# Altium project OK10xx_S V1.1.PrjPCB
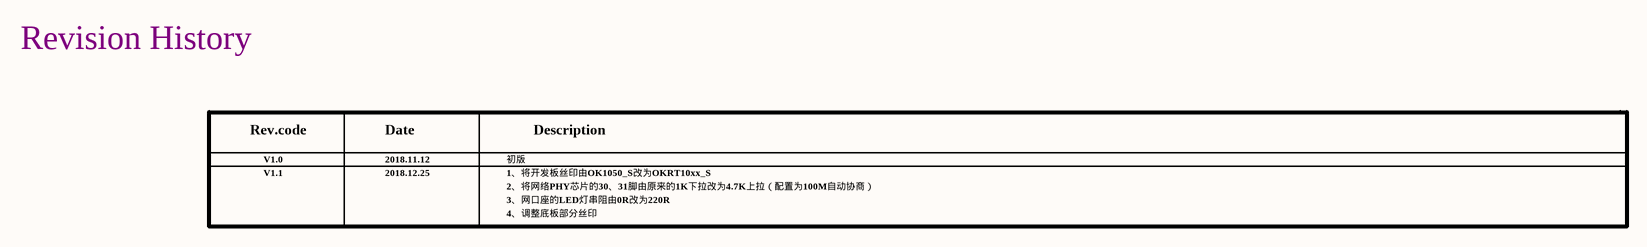
[diagram p0: RELEASE.SchDoc]
7 sheets, 234 parts. Net scope: global (net labels, ports and power ports of the same name join across sheets).
Board file: OK10xx_S V1.1.PcbDoc
Sheets:
  RELEASE.SchDoc
  POWER&RTC.SchDoc
  NET.SchDoc
  AUDIO.SchDoc
  OK10xx_S V1.1.SchDoc
  TF_CARD&USB.SchDoc
  Camera.SchDoc

## Sheet RELEASE.SchDoc
size A3; Revision: 1.0; SheetNumber: 1; SheetTotal: 7

### Notes on the sheet
- Revision History
- Rev.code
- Date
- Description
- V1.0
- V1.1
- 2018.11.12
- 2018.12.25
- 初版
- 1、将开发板丝印由OK1050_S改为OKRT10xx_S
- 2、将网络PHY芯片的30、31脚由原来的1K下拉改为4.7K上拉（配置为100M自动协商）
- 3、网口座的LED灯串阻由0R改为220R
- 4、调整底板部分丝印
- 设计
- 审核
- 工艺
- 图纸名称
- 郝成东
- 批准
- 标准化
- 日期
- 版本
- 页码
- 第
- 页
- 共

## Sheet POWER&RTC.SchDoc
size A3; Revision: 1.0; SheetNumber: 3; SheetTotal: 7
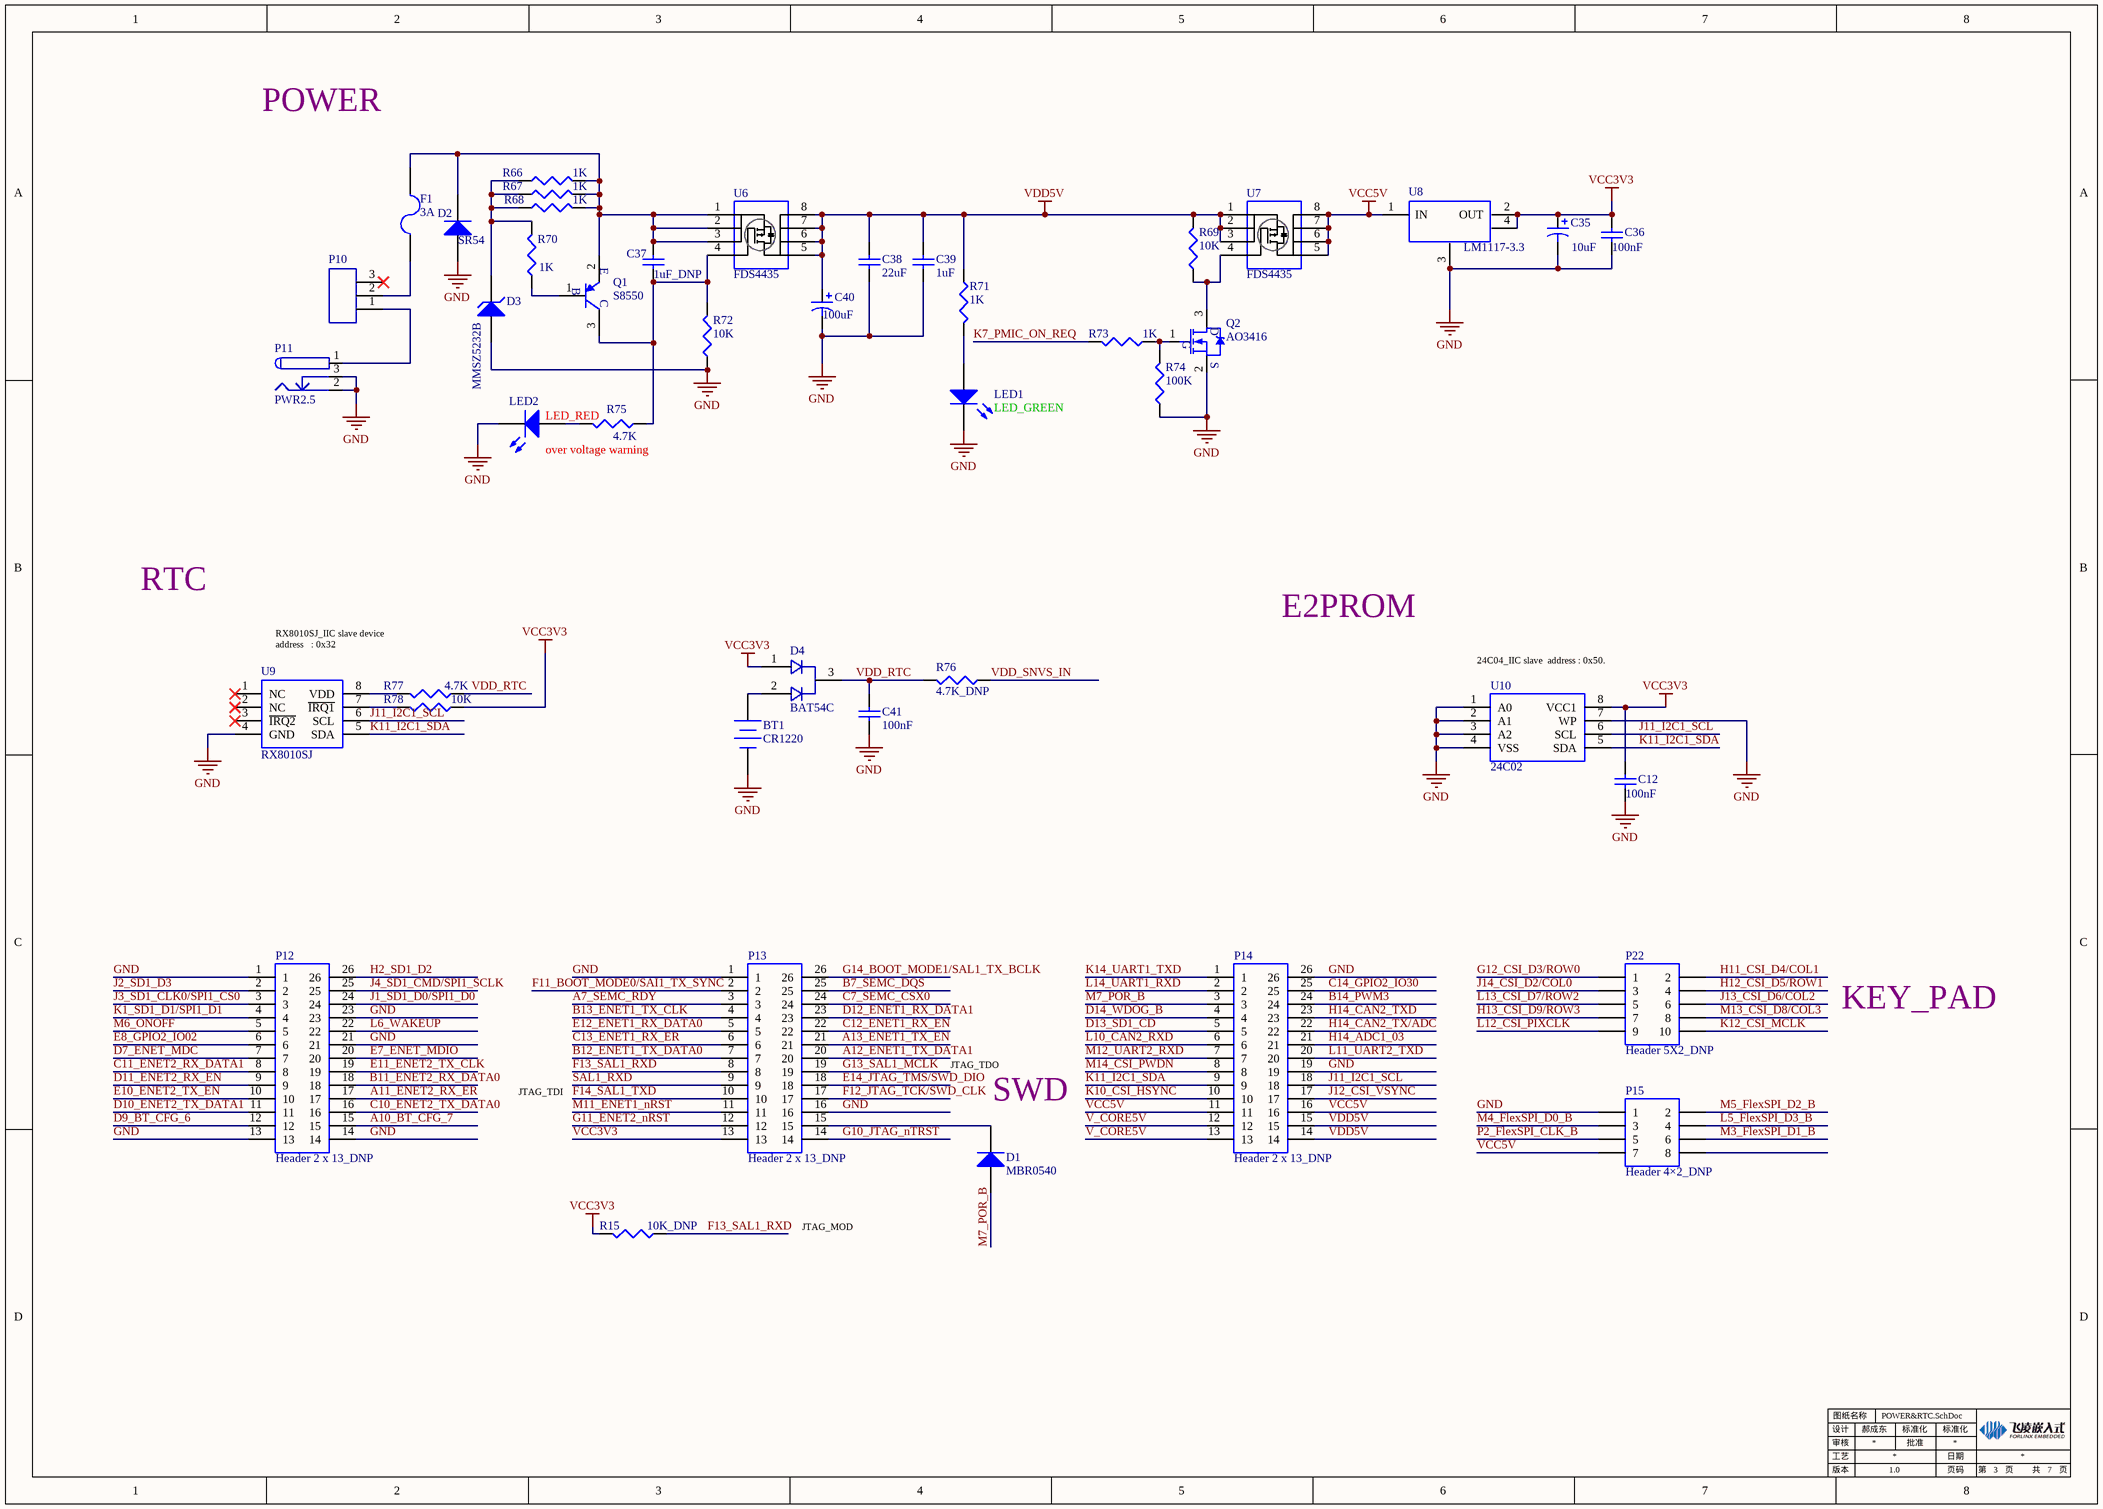
[diagram p1: POWER&RTC.SchDoc]

### Parts
BT1  CR1220  [BH-1220 BATTERY]
C12  100nF  [0603C+]
C35  10uF  [TC3216A]
C36  100nF  [0603C+]
C37  1uF_DNP  [0603C+]
C38  22uF  [0603C+]
C39  1uF  [0603C+]
C40  100uF  [TC3528B]
C41  100nF  [0603C+]
D1  MBR0540  [Diode1.6*2.6]
D2  SR54  [SMB/DO-214AA]
D3  MMSZ5232B  [Diode1.6*2.6]
D4  BAT54C  [SOT23]
F1  3A  [R_1210]
LED1  LED_GREEN  [LED0603_M1608]
LED2  LED_RED  [LED0603_M1608]
P10  P18  [SW01]  (value not drawn)
P11  PWR2.5  [JACK-2.5MM_B]
P12  Header 2 x 13_DNP  [HDR2X13]
P13  Header 2 x 13_DNP  [HDR2X13]
P14  Header 2 x 13_DNP  [HDR2X13]
P15  Header 4×2_DNP  [HDR2X4]
P22  Header 5X2_DNP  [HDR2X5]
Q1  S8550  [SOT95P245X110-3N]
Q2  AO3416  [SOT95P245X110-3N]
R15  10K_DNP  [0603R+]
R66  1K  [0603R+]
R67  1K  [0603R+]
R68  1K  [0603R+]
R69  10K  [0603R+]
R70  1K  [0603R+]
R71  1K  [0603R+]
R72  10K  [0603R+]
R73  1K  [0603R+]
R74  100K  [0603R+]
R75  4.7K  [0603R+]
R76  4.7K_DNP  [0603R+]
R77  4.7K  [0603R+]
R78  10K  [0603R+]
U6  FDS4435  [FDS4435]
U7  FDS4435  [FDS4435]
U8  LM1117-3.3  [LM1117]
U9  RX8010SJ  [RX8010SJ]
U10  24C02  [24C04_SO8]

### Nets
GND: BT1.2(-) C12.1 C35.2 C36.1 C38.2 C39.2 C40.2 C41.1 D2.1(A) D3.1(A) LED1.2(K) LED2.2(K) P11.2(ADJ) P11.3(ADJ) P12.1 P12.13 P12.14 P12.21 P12.23 P13.1 P13.16 P14.19 P14.26 P15.1 Q2.2(S) R72.1 R74.1 U8.3(GND) U9.4(GND) U10.1(A0) U10.2(A1) U10.3(A2) U10.4(VSS) U10.7(WP)
VCC3V3: C12.2 C35.1 C36.2 D4.1 P13.13 R15.2 R78.1 U8.2(OUT) U8.4 U10.8(VCC1)
VCC5V: P14.11 P14.16 P15.7 U7.5(D) U7.6(D) U7.7(D) U7.8(D) U8.1(IN)
VDD5V: C38.1 C39.1 C40.1 P14.14 P14.15 R69.2 R71.1 U6.5(D) U6.6(D) U6.7(D) U6.8(D) U7.1(S) U7.2(S) U7.3(S)
A7_SEMC_RDY: P13.3
A10_BT_CFG_7: P12.15
A11_ENET2_RX_ER: P12.17
A12_ENET1_TX_DATA1: P13.20
A13_ENET1_TX_EN: P13.21
B7_SEMC_DQS: P13.25
B11_ENET2_RX_DATA0: P12.18
B12_ENET1_TX_DATA0: P13.7
B13_ENET1_TX_CLK: P13.4
B14_PWM3: P14.24
C7_SEMC_CSX0: P13.24
C10_ENET2_TX_DATA0: P12.16
C11_ENET2_RX_DATA1: P12.8
C12_ENET1_RX_EN: P13.22
C13_ENET1_RX_ER: P13.6
C14_GPIO2_IO30: P14.25
D7_ENET_MDC: P12.7
D9_BT_CFG_6: P12.12
D10_ENET2_TX_DATA1: P12.11
D11_ENET2_RX_EN: P12.9
D12_ENET1_RX_DATA1: P13.23
D13_SD1_CD: P14.5
D14_WDOG_B: P14.4
E7_ENET_MDIO: P12.20
E8_GPIO2_IO02: P12.6
E10_ENET2_TX_EN: P12.10
E11_ENET2_TX_CLK: P12.19
E12_ENET1_RX_DATA0: P13.5
E14_JTAG_TMS/SWD_DIO: P13.18
F11_BOOT_MODE0/SAI1_TX_SYNC: P13.2
F12_JTAG_TCK/SWD_CLK: P13.17
F13_SAL1_RXD: P13.8 R15.1
F14_SAL1_TXD: P13.10
G10_JTAG_nTRST: P13.14
G11_ENET2_nRST: P13.12
G12_CSI_D3/ROW0: P22.1
G13_SAL1_MCLK: P13.19
G14_BOOT_MODE1/SAL1_TX_BCLK: P13.26
H2_SD1_D2: P12.26
H11_CSI_D4/COL1: P22.2
H12_CSI_D5/ROW1: P22.4
H13_CSI_D9/ROW3: P22.7
H14_ADC1_03: P14.21
H14_CAN2_TX/ADC: P14.22
H14_CAN2_TXD: P14.23
J1_SD1_D0/SPI1_D0: P12.24
J2_SD1_D3: P12.2
J3_SD1_CLK0/SPI1_CS0: P12.3
J4_SD1_CMD/SPI1_SCLK: P12.25
J11_I2C1_SCL: P14.18 U9.6(SCL) U10.6(SCL)
J12_CSI_VSYNC: P14.17
J13_CSI_D6/COL2: P22.6
J14_CSI_D2/COL0: P22.3
K1_SD1_D1/SPI1_D1: P12.4
K7_PMIC_ON_REQ: R73.2
K10_CSI_HSYNC: P14.10
K11_I2C1_SDA: P14.9 U9.5(SDA) U10.5(SDA)
K12_CSI_MCLK: P22.10
K14_UART1_TXD: P14.1
L5_FlexSPI_D3_B: P15.4
L6_WAKEUP: P12.22
L10_CAN2_RXD: P14.6
L11_UART2_TXD: P14.20
L12_CSI_PIXCLK: P22.9
L13_CSI_D7/ROW2: P22.5
L14_UART1_RXD: P14.2
M3_FlexSPI_D1_B: P15.6
M4_FlexSPI_D0_B: P15.3
M5_FlexSPI_D2_B: P15.2
M6_ONOFF: P12.5
M7_POR_B: D1.1(A) P14.3
M11_ENET1_nRST: P13.11
M12_UART2_RXD: P14.7
M13_CSI_D8/COL3: P22.8
M14_CSI_PWDN: P14.8
P2_FlexSPI_CLK_B: P15.5
SAL1_RXD: P13.9
V_CORE5V: P14.12 P14.13
VDD_RTC: C41.2 D4.3 R76.2 R77.1
VDD_SNVS_IN: R76.1
NetBT1_1: BT1.1(+) D4.2
NetC37_1: C37.1 D2.2(K) F1.2 Q1.2(E) R66.2 R67.2 R68.2 U6.1(S) U6.2(S) U6.3(S)
NetC37_2: C37.2 Q1.3(C) R72.2 R75.1 U6.4(G)
NetD1_2: D1.2(K) P13.15
NetD3_2: D3.2(K) R66.1 R67.1 R68.1 R70.2
NetF1_1: F1.1 P10.2(DQ17)
NetLED1_1: LED1.1(A) R71.2
NetLED2_1: LED2.1(A) R75.2
NetP10_1: P10.1(DQ16) P11.1(ADJ)
NetQ1_1: Q1.1(B) R70.1
NetQ2_1: Q2.1(G) R73.1 R74.2
NetQ2_3: Q2.3(D) R69.1 U7.4(G)
NetR77_2: R77.2 U9.8(VDD)
NetR78_2: R78.2 U9.7(~{IRQ1})

Not connected (* = marked no-connect by the designer): P10 3(DQ18)*; P15 8; U9 1(NC)* 2(NC)* 3(~{IRQ2})*

### Notes on the sheet
- POWER
- over voltage warning
- RTC
- RX8010SJ_IIC slave device address   : 0x32
- E2PROM
- (near U10) 24C04_IIC slave  address : 0x50.
- KEY_PAD
- JTAG_TDI
- JTAG_TDO
- (near D1) SWD
- JTAG_MOD
- 设计
- 审核
- 工艺
- 图纸名称
- 郝成东
- 批准
- 标准化
- 日期
- 版本
- 页码
- 第
- 页
- 共

### Library data of the parts
BT1 = Battery: Multicell Battery; Published: 24-Mar-1999; LatestRevisionDate: 17-Jul-2002; LatestRevisionNote: Re-released for DXP Platform.; PackageReference: BAT-2; Publisher: Altium Limited; PackageDescription: Battery; 2 Leads
C12 C36 = CAP: Capacitor; Value: 100nF; Published: 8-Jun-2000; LatestRevisionDate: 17-Jul-2002; LatestRevisionNote: Re-released for DXP Platform.; PackageReference: RAD-0.3; Publisher: Altium Limited; PackageDescription: Radial Cap, Thru-Hole; 2 Leads; 0.3 in Pin Spacing
C35 C40 = Cap Pol1: Polarized Capacitor (Radial); Published: 8-Jun-2000; LatestRevisionDate: 17-Jul-2002; LatestRevisionNote: Re-released for DXP Platform.; PackageReference: RB7.6-15; Publisher: Altium Limited; PackageDescription: Polarized Capacitor (Radial); 2 Leads
  C35: Value: 10uF
  C40: Value: 100uF
C37-C39 C41 = Cap: Capacitor; Published: 8-Jun-2000; LatestRevisionDate: 17-Jul-2002; LatestRevisionNote: Re-released for DXP Platform.; PackageReference: RAD-0.3; Publisher: Altium Limited; PackageDescription: Radial Cap, Thru-Hole; 2 Leads; 0.3 in Pin Spacing
  C37: Value: 1uF_DNP
  C38: Value: 22uF
  C39: Value: 1uF
  C41: Value: 100nF
D1 D2 = Diode: Default Diode; Published: 8-Jun-2000; LatestRevisionDate: 17-Jul-2002; LatestRevisionNote: Re-released for DXP Platform.; PackageVersion: Sep-1996; PackageReference: SMC; Publisher: Altium Limited; PackageDescription: DO-214-AB/SMC; 2 C-Bend Leads; Body 7.9 x 5.9 mm, inc. leads (LxW); Code_JEDEC: DO-214-AB
D3 = D Zener: Zener Diode; Published: 8-Jun-2000; LatestRevisionDate: 17-Jul-2002; LatestRevisionNote: Re-released for DXP Platform.; PackageReference: DIODE-0.7; Publisher: Altium Limited; PackageDescription: Diode, Thru-Hole; 2 Leads; 0.7 in Pin Spacing
F1 = Fuse 2: Fuse; Published: 8-Jun-2000; LatestRevisionDate: 17-Jul-2002; LatestRevisionNote: Re-released for DXP Platform.; PackageReference: PIN-W2/E2.8; Publisher: Altium Limited; PackageDescription: Thru-Hole; 2 Leads; Value: 3A
LED1 LED2 = LED2: Typical RED, GREEN, YELLOW, AMBER GaAs LED; Published: 8-Jun-2000; LatestRevisionDate: 17-Jul-2002; LatestRevisionNote: Re-released for DXP Platform.; PackageVersion: Feb-2002; PackageReference: 3.2X1.6X1.1; Publisher: Altium Limited; PackageDescription: SM LED; 2 Flat Leads; Value: RED
P10 = CON3
P12-P14 = Header 2 x 13
P15 = Header 4×2
P22 = Header 5X2: Header, 5-Pin, Dual row; LatestRevisionDate: 17-Jul-2002; LatestRevisionNote: Re-released for DXP Platform.; Publisher: Altium Limited
Q1 = PNP: NPN Bipolar Transistor; Published: 8-Jun-2000; LatestRevisionDate: 17-Jul-2002; LatestRevisionNote: Re-released for DXP Platform.; PackageReference: TO-226-AA; Publisher: Altium Limited; PackageDescription: TO, Flat Index; 3 In-Line, Axial Leads; Body Dia. 4.8mm; Leads 0.55 x 0.51 mm (max); Code_JEDEC: TO-226-AA; VALUE: S8550
Q2 = NMOS: N-Channel Power MOSFET; Note: Pin 2 is electrically connected to pin 4.; Published: 8-Jun-2000; LatestRevisionDate: 17-Jul-2002; LatestRevisionNote: Re-released for DXP Platform.; DatasheetVersion: PD-9.814; PackageVersion: Feb-1997; PackageReference: TO-220AB; Publisher: Altium Limited; PackageDescription: TO, Thru-Hole, Vertical, Heatsink Mounted; 3 In-Line Leads; Pitch 2.54 mm; ComponentLink1Description: Manufacturer Link; ComponentLink1URL: http://www.irf.com/; VALUE: AO3416
R15 R66-R78 = Res3: Resistor; Published: 8-Jun-2000; LatestRevisionDate: 29-May-2009; LatestRevisionNote: IPC-7351 Footprint Added.; PackageReference: J1-0603; Publisher: Altium Limited; PackageDescription: Chip Resistor
  R15: Value: 10K_DNP
  R66-R68 R70 R71 R73: Value: 1K
  R69 R72 R78: Value: 10K
  R74: Value: 100K
  R75 R77: Value: 4.7K
  R76: Value: 4.7K_DNP
U8 = LM1117: Value: LM1117-3.3
U10 = 24C04_SO8
D4 = BAT54C: Value: BAT54C
U9 = RX8010SJ: Value: RX8010SJ

## Sheet NET.SchDoc
size A3; Revision: 1.0; SheetNumber: 4; SheetTotal: 7
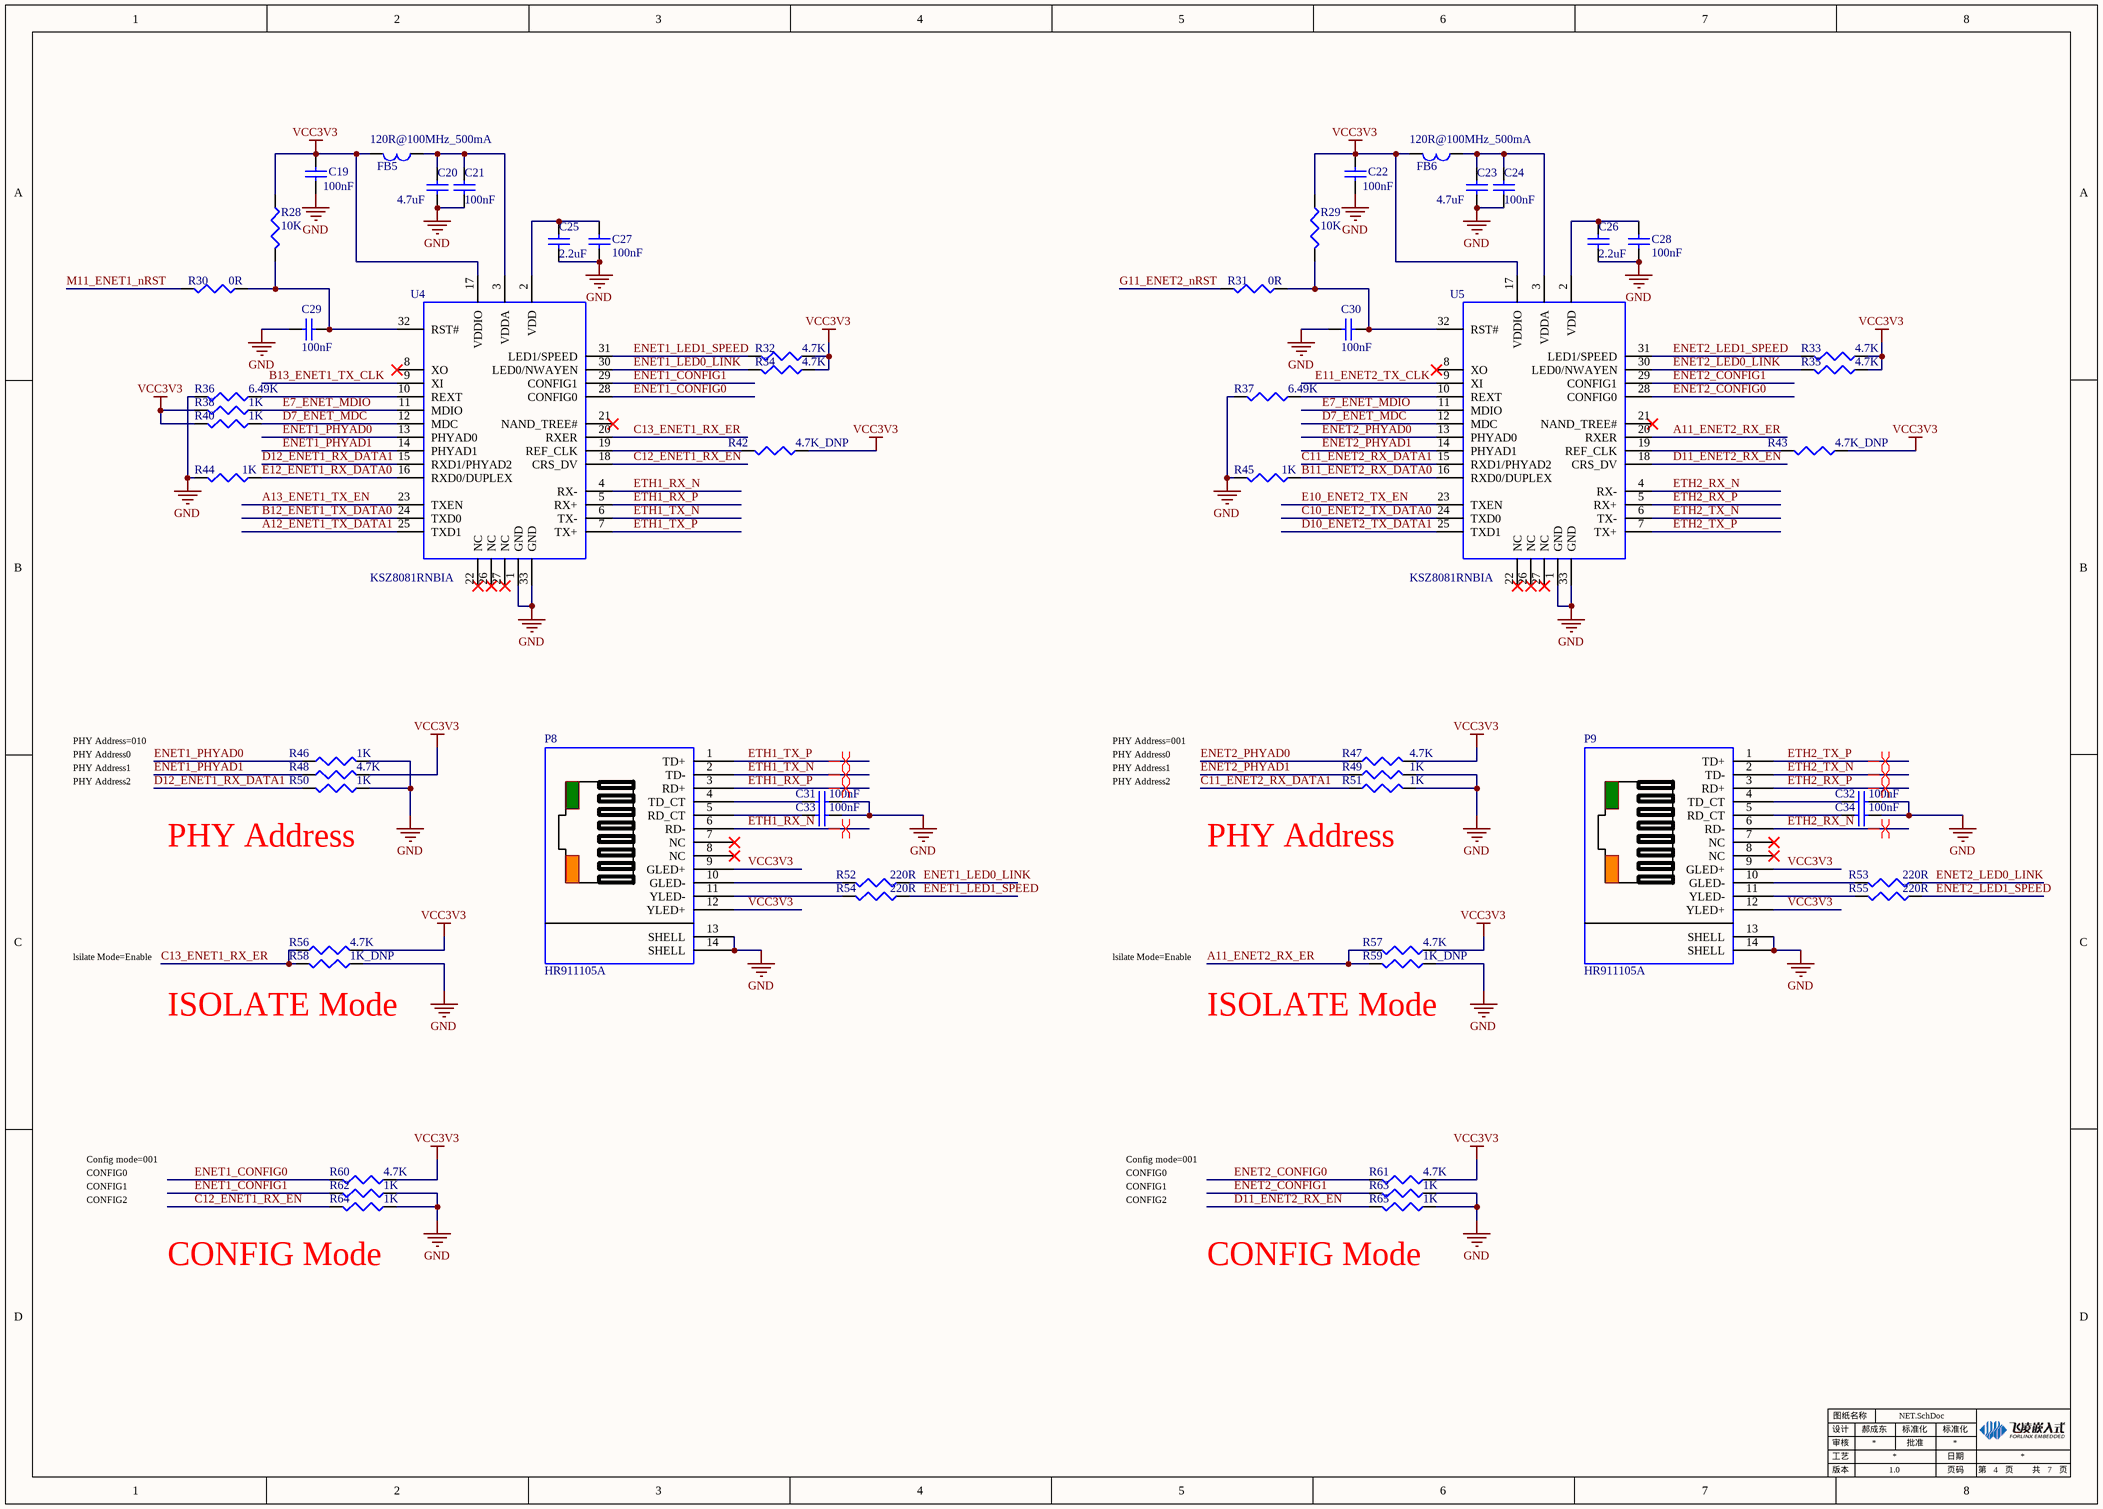
[diagram p2: NET.SchDoc]

### Parts
C19  100nF  [0603C+]
C20  4.7uF  [0603C+]
C21  100nF  [0603C+]
C22  100nF  [0603C+]
C23  4.7uF  [0603C+]
C24  100nF  [0603C+]
C25  2.2uF  [0603C+]
C26  2.2uF  [0603C+]
C27  100nF  [0603C+]
C28  100nF  [0603C+]
C29  100nF  [0603C+]
C30  100nF  [0603C+]
C31  100nF  [0603C+]
C32  100nF  [0603C+]
C33  100nF  [0603C+]
C34  100nF  [0603C+]
FB5  120R@100MHz_500mA  [0603R+]
FB6  120R@100MHz_500mA  [0603R+]
P8  HR911105A  [RJ-45A12]
P9  HR911105A  [RJ-45A12]
R28  10K  [0603R+]
R29  10K  [0603R+]
R30  0R  [0603R+]
R31  0R  [0603R+]
R32  4.7K  [0603R+]
R33  4.7K  [0603R+]
R34  4.7K  [0603R+]
R35  4.7K  [0603R+]
R36  6.49K  [0603R+]
R37  6.49K  [0603R+]
R38  1K  [0603R+]
R40  1K  [0603R+]
R42  4.7K_DNP  [0603R+]
R43  4.7K_DNP  [0603R+]
R44  1K  [0603R+]
R45  1K  [0603R+]
R46  1K  [0603R+]
R47  4.7K  [0603R+]
R48  4.7K  [0603R+]
R49  1K  [0603R+]
R50  1K  [0603R+]
R51  1K  [0603R+]
R52  220R  [0603R+]
R53  220R  [0603R+]
R54  220R  [0603R+]
R55  220R  [0603R+]
R56  4.7K  [0603R+]
R57  4.7K  [0603R+]
R58  1K_DNP  [0603R+]
R59  1K_DNP  [0603R+]
R60  4.7K  [0603R+]
R61  4.7K  [0603R+]
R62  1K  [0603R+]
R63  1K  [0603R+]
R64  1K  [0603R+]
R65  1K  [0603R+]
U4  KSZ8081RNBIA  [QFN-32]
U5  KSZ8081RNBIA  [QFN-32]

### Nets
GND: C19.2 C20.2 C21.2 C22.2 C23.2 C24.2 C25.2 C26.2 C27.2 C28.2 C29.1 C30.1 C31.1 C32.1 C33.1 C34.1 P8.13(SHELL) P8.14(SHELL) P9.13(SHELL) P9.14(SHELL) R36.2 R37.2 R44.2 R45.2 R46.2 R49.2 R50.1 R51.2 R58.1 R59.1 R62.1 R63.1 R64.1 R65.1 U4.1(GND) U4.33(GND) U5.1(GND) U5.33(GND)
VCC3V3: C19.1 C22.1 FB5.2 FB6.2 P8.9(GLED+) P8.12(YLED+) P9.9(GLED+) P9.12(YLED+) R28.1 R29.1 R32.1 R33.1 R34.1 R35.1 R38.2 R40.2 R42.1 R43.1 R47.2 R48.2 R56.2 R57.1 R60.1 R61.1 U4.17(VDDIO) U5.17(VDDIO)
A11_ENET2_RX_ER: R57.2 R59.2 U5.20(RXER)
A12_ENET1_TX_DATA1: U4.25(TXD1)
A13_ENET1_TX_EN: U4.23(TXEN)
B11_ENET2_RX_DATA0: R45.1 U5.16(RXD0/DUPLEX)
B12_ENET1_TX_DATA0: U4.24(TXD0)
B13_ENET1_TX_CLK: U4.9(XI)
C10_ENET2_TX_DATA0: U5.24(TXD0)
C11_ENET2_RX_DATA1: R51.1 U5.15(RXD1/PHYAD2)
C12_ENET1_RX_EN: R64.2 U4.18(CRS_DV)
C13_ENET1_RX_ER: R56.1 R58.2 U4.20(RXER)
D7_ENET_MDC: R40.1 U4.12(MDC) U5.12(MDC)
D10_ENET2_TX_DATA1: U5.25(TXD1)
D11_ENET2_RX_EN: R65.2 U5.18(CRS_DV)
D12_ENET1_RX_DATA1: R50.2 U4.15(RXD1/PHYAD2)
E7_ENET_MDIO: R38.1 U4.11(MDIO) U5.11(MDIO)
E10_ENET2_TX_EN: U5.23(TXEN)
E11_ENET2_TX_CLK: U5.9(XI)
E12_ENET1_RX_DATA0: R44.1 U4.16(RXD0/DUPLEX)
ENET1_CONFIG0: R60.2 U4.28(CONFIG0)
ENET1_CONFIG1: R62.2 U4.29(CONFIG1)
ENET1_LED0_LINK: R34.2 R52.1 U4.30(LED0/NWAYEN)
ENET1_LED1_SPEED: R32.2 R54.1 U4.31(LED1/SPEED)
ENET1_PHYAD0: R46.1 U4.13(PHYAD0)
ENET1_PHYAD1: R48.1 U4.14(PHYAD1)
ENET2_CONFIG0: R61.2 U5.28(CONFIG0)
ENET2_CONFIG1: R63.2 U5.29(CONFIG1)
ENET2_LED0_LINK: R35.2 R53.1 U5.30(LED0/NWAYEN)
ENET2_LED1_SPEED: R33.2 R55.1 U5.31(LED1/SPEED)
ENET2_PHYAD0: R47.1 U5.13(PHYAD0)
ENET2_PHYAD1: R49.1 U5.14(PHYAD1)
ETH1_RX_N: P8.6(RD-) U4.4(RX-)
ETH1_RX_P: P8.3(RD+) U4.5(RX+)
ETH1_TX_N: P8.2(TD-) U4.6(TX-)
ETH1_TX_P: P8.1(TD+) U4.7(TX+)
ETH2_RX_N: P9.6(RD-) U5.4(RX-)
ETH2_RX_P: P9.3(RD+) U5.5(RX+)
ETH2_TX_N: P9.2(TD-) U5.6(TX-)
ETH2_TX_P: P9.1(TD+) U5.7(TX+)
G11_ENET2_nRST: R31.2
M11_ENET1_nRST: R30.2
NetC20_1: C20.1 C21.1 FB5.1 U4.3(VDDA)
NetC23_1: C23.1 C24.1 FB6.1 U5.3(VDDA)
NetC25_1: C25.1 C27.1 U4.2(VDD)
NetC26_1: C26.1 C28.1 U5.2(VDD)
NetC29_2: C29.2 R28.2 R30.1 U4.32(RST#)
NetC30_2: C30.2 R29.2 R31.1 U5.32(RST#)
NetC31_2: C31.2 P8.4(TD_CT)
NetC32_2: C32.2 P9.4(TD_CT)
NetC33_2: C33.2 P8.5(RD_CT)
NetC34_2: C34.2 P9.5(RD_CT)
NetP8_10: P8.10(GLED-) R52.2
NetP8_11: P8.11(YLED-) R54.2
NetP9_10: P9.10(GLED-) R53.2
NetP9_11: P9.11(YLED-) R55.2
NetR36_1: R36.1 U4.10(REXT)
NetR37_1: R37.1 U5.10(REXT)
NetR42_2: R42.2 U4.19(REF_CLK)
NetR43_2: R43.2 U5.19(REF_CLK)

Not connected (* = marked no-connect by the designer): P8 7(NC)* 8(NC)*; P9 7(NC)* 8(NC)*; U4 8(XO)* 21(NAND_TREE#)* 22(NC)* 26(NC)* 27(NC)*; U5 8(XO)* 21(NAND_TREE#)* 22(NC)* 26(NC)* 27(NC)*

### Layout directives
differential pair: ETH1_RX_N, ETH1_RX_P, ETH1_TX_N, ETH1_TX_P, ETH2_RX_N, ETH2_RX_P, ETH2_TX_N, ETH2_TX_P

### Notes on the sheet
- PHY Address0
- PHY Address1
- PHY Address2
- PHY Address=010
- PHY Address=001
- PHY Address
- lsilate Mode=Enable
- ISOLATE Mode
- Config mode=001
- CONFIG0
- CONFIG1
- CONFIG2
- CONFIG Mode
- 设计
- 审核
- 工艺
- 图纸名称
- 郝成东
- 批准
- 标准化
- 日期
- 版本
- 页码
- 第
- 页
- 共

### Library data of the parts
C19-C34 = Cap: Capacitor; Published: 8-Jun-2000; LatestRevisionDate: 17-Jul-2002; LatestRevisionNote: Re-released for DXP Platform.; PackageReference: RAD-0.3; Publisher: Altium Limited; PackageDescription: Radial Cap, Thru-Hole; 2 Leads; 0.3 in Pin Spacing
  C19 C21 C22 C24 C27-C34: Value: 100nF
  C20 C23: Value: 4.7uF
  C25 C26: Value: 2.2uF
FB5 FB6 = CZ: Inductor; Code_IEC: 1005; Published: 8-Jun-2000; LatestRevisionDate: 29-May-2009; LatestRevisionNote: IPC-7351 Footprint Added.; PackageReference: 0402-A; Publisher: 120R@100MHz_500mA; PackageDescription: Chip Inductor; Code_JEITA: 0402; value: 120R@100MHz_500mA
R28-R38 R40 R42-R65 = Res3: Resistor; Published: 8-Jun-2000; LatestRevisionDate: 29-May-2009; LatestRevisionNote: IPC-7351 Footprint Added.; PackageReference: J1-0603; Publisher: Altium Limited; PackageDescription: Chip Resistor
  R28 R29: Value: 10K
  R30 R31: Value: 0R
  R32-R35 R47 R48 R56 R57 R60 R61: Value: 4.7K
  R36 R37: Value: 6.49K
  R38 R40 R44-R46 R49-R51 R62-R65: Value: 1K
  R42 R43: Value: 4.7K_DNP
  R52-R55: Value: 220R
  R58 R59: Value: 1K_DNP
U4 U5 = KSZ8081RNB

## Sheet AUDIO.SchDoc
size A3; Revision: 1.0; SheetNumber: 5; SheetTotal: 7
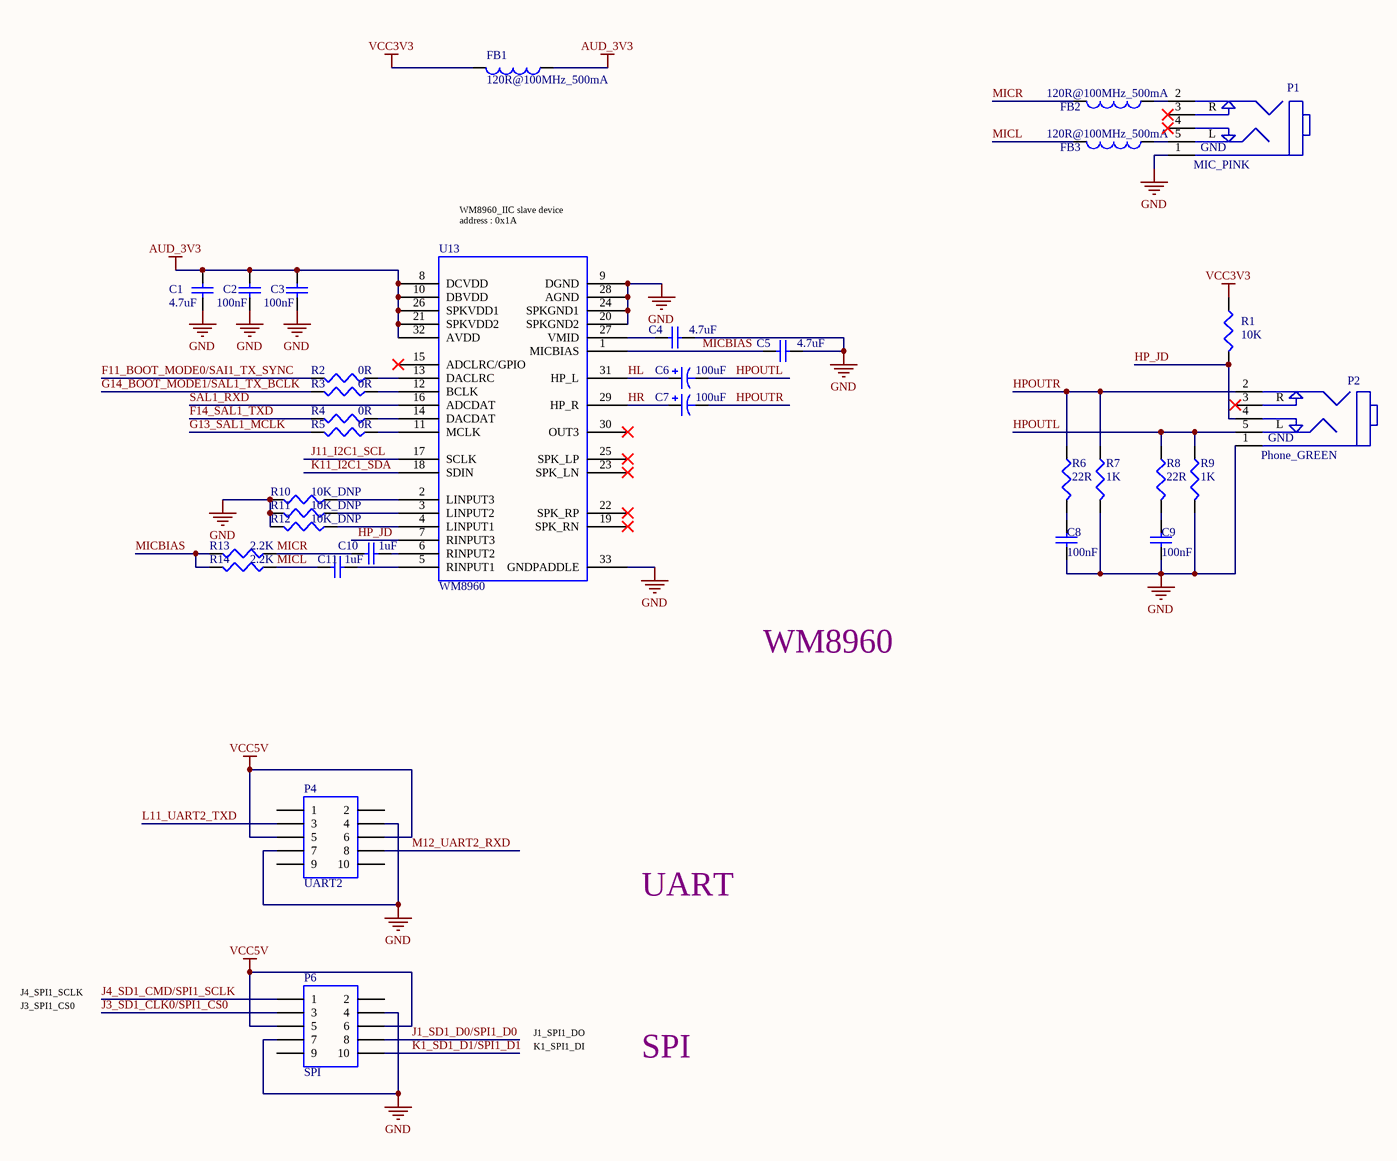
[diagram p3: AUDIO.SchDoc]

### Parts
C1  4.7uF  [0603C+]
C2  100nF  [0603C+]
C3  100nF  [0603C+]
C4  4.7uF  [0603C+]
C5  4.7uF  [0603C+]
C6  100uF  [TC3528B]
C7  100uF  [TC3528B]
C8  100nF  [0603C+]
C9  100nF  [0603C+]
C10  1uF  [0603C+]
C11  1uF  [0603C+]
FB1  120R@100MHz_500mA  [0603R+]
FB2  120R@100MHz_500mA  [0603R+]
FB3  120R@100MHz_500mA  [0603R+]
P1  MIC_PINK  [PHONEJACK SW]
P2  Phone_GREEN  [PHONEJACK SW]
P4  UART2  [IDC10S]
P6  SPI  [IDC10S]
R1  10K  [0603R+]
R2  0R  [0603R+]
R3  0R  [0603R+]
R4  0R  [0603R+]
R5  0R  [0603R+]
R6  22R  [0603R+]
R7  1K  [0603R+]
R8  22R  [0603R+]
R9  1K  [0603R+]
R10  10K_DNP  [0603R+]
R11  10K_DNP  [0603R+]
R12  10K_DNP  [0603R+]
R13  2.2K  [0603R+]
R14  2.2K  [0603R+]
U13  WM8960  [WM8960]

### Nets
AUD_3V3: C1.2 C2.2 C3.2 FB1.1 U13.8(DCVDD) U13.10(DBVDD) U13.21(SPKVDD2) U13.26(SPKVDD1) U13.32(AVDD)
GND: C1.1 C2.1 C3.1 C4.1 C5.1 C8.2 C9.2 P1.1(GND) P2.1(GND) P4.4 P4.7 P6.4 P6.7 R7.2 R9.2 R10.2 R11.2 R12.2 U13.9(DGND) U13.20(SPKGND2) U13.24(SPKGND1) U13.28(AGND) U13.33(GNDPADDLE)
VCC3V3: FB1.2 R1.1
VCC5V: P4.5 P4.6 P6.5 P6.6
F11_BOOT_MODE0/SAI1_TX_SYNC: R2.2
F14_SAL1_TXD: R4.2
G13_SAL1_MCLK: R5.2
G14_BOOT_MODE1/SAL1_TX_BCLK: R3.2
HL: C6.1 U13.31(HP_L)
HP_JD: P2.4 R1.2 U13.7(RINPUT3)
HPOUTL: C6.2 P2.5 R8.1 R9.1
HPOUTR: C7.2 P2.2 R6.1 R7.1
HR: C7.1 U13.29(HP_R)
J1_SD1_D0/SPI1_D0: P6.8
J3_SD1_CLK0/SPI1_CS0: P6.3
J4_SD1_CMD/SPI1_SCLK: P6.1
J11_I2C1_SCL: U13.17(SCLK)
K1_SD1_D1/SPI1_D1: P6.10
K11_I2C1_SDA: U13.18(SDIN)
L11_UART2_TXD: P4.3
M12_UART2_RXD: P4.8
MICBIAS: C5.2 R13.2 R14.2 U13.1(MICBIAS)
MICL: C11.2 FB3.2 R14.1
MICR: C10.2 FB2.2 R13.1
SAL1_RXD: U13.16(ADCDAT)
NetC4_2: C4.2 U13.27(VMID)
NetC8_1: C8.1 R6.2
NetC9_1: C9.1 R8.2
NetC10_1: C10.1 U13.6(RINPUT2)
NetC11_1: C11.1 U13.5(RINPUT1)
NetFB2_1: FB2.1 P1.2
NetFB3_1: FB3.1 P1.5
NetR2_1: R2.1 U13.13(DACLRC)
NetR3_1: R3.1 U13.12(BCLK)
NetR4_1: R4.1 U13.14(DACDAT)
NetR5_1: R5.1 U13.11(MCLK)
NetR10_1: R10.1 U13.2(LINPUT3)
NetR11_1: R11.1 U13.3(LINPUT2)
NetR12_1: R12.1 U13.4(LINPUT1)

Not connected (* = marked no-connect by the designer): P1 3* 4*; P2 3*; P4 1 2 9 10; P6 2 9; U13 15(ADCLRC/GPIO)* 19(SPK_RN)* 22(SPK_RP)* 23(SPK_LN)* 25(SPK_LP)* 30(OUT3)*

### Notes on the sheet
- WM8960_IIC slave device address : 0x1A
- WM8960
- UART
- SPI
- Labels drawn without touching a wire or pin: J1_SPI1_DO, J3_SPI1_CS0, J4_SPI1_SCLK, K1_SPI1_DI
- 设计
- 审核
- 工艺
- 图纸名称
- 郝成东
- 批准
- 标准化
- 日期
- 版本
- 页码
- 第
- 页
- 共
- (in symbol Phonejack Stereo SW) R; L

### Library data of the parts
C1-C5 C8-C11 = Cap: Capacitor; Published: 8-Jun-2000; LatestRevisionDate: 17-Jul-2002; LatestRevisionNote: Re-released for DXP Platform.; PackageReference: RAD-0.3; Publisher: Altium Limited; PackageDescription: Radial Cap, Thru-Hole; 2 Leads; 0.3 in Pin Spacing
  C1 C4 C5: Value: 4.7uF
  C2 C3 C8 C9: Value: 100nF
  C10 C11: Value: 1uF
C6 C7 = Cap Pol1: Polarized Capacitor (Radial); Published: 8-Jun-2000; LatestRevisionDate: 17-Jul-2002; LatestRevisionNote: Re-released for DXP Platform.; PackageReference: RB7.6-15; Publisher: Altium Limited; PackageDescription: Polarized Capacitor (Radial); 2 Leads; Value: 100uF
FB1-FB3 = Inductor: Code_IEC: 1005; Published: 8-Jun-2000; LatestRevisionDate: 29-May-2009; LatestRevisionNote: IPC-7351 Footprint Added.; PackageReference: 0402-A; Publisher: Altium Limited; PackageDescription: Chip Inductor; Code_JEITA: 0402; Value: 120R@100MHz_500mA
P1 P2 = Phonejack Stereo SW: VALUE: HEDAJACK
P4 P6 = Header 5X2: Header, 5-Pin, Dual row; LatestRevisionDate: 17-Jul-2002; LatestRevisionNote: Re-released for DXP Platform.; Publisher: Altium Limited
R1-R14 = Res3: Resistor; Published: 8-Jun-2000; LatestRevisionDate: 29-May-2009; LatestRevisionNote: IPC-7351 Footprint Added.; PackageReference: J1-0603; Publisher: Altium Limited; PackageDescription: Chip Resistor
  R1: Value: 10K
  R2-R5: Value: 0R
  R6 R8: Value: 22R
  R7 R9: Value: 1K
  R10-R12: Value: 10K_DNP
  R13 R14: Value: 2.2K

## Sheet OK10xx_S V1.1.SchDoc
size A3; Revision: 1.0; SheetNumber: 2; SheetTotal: 7
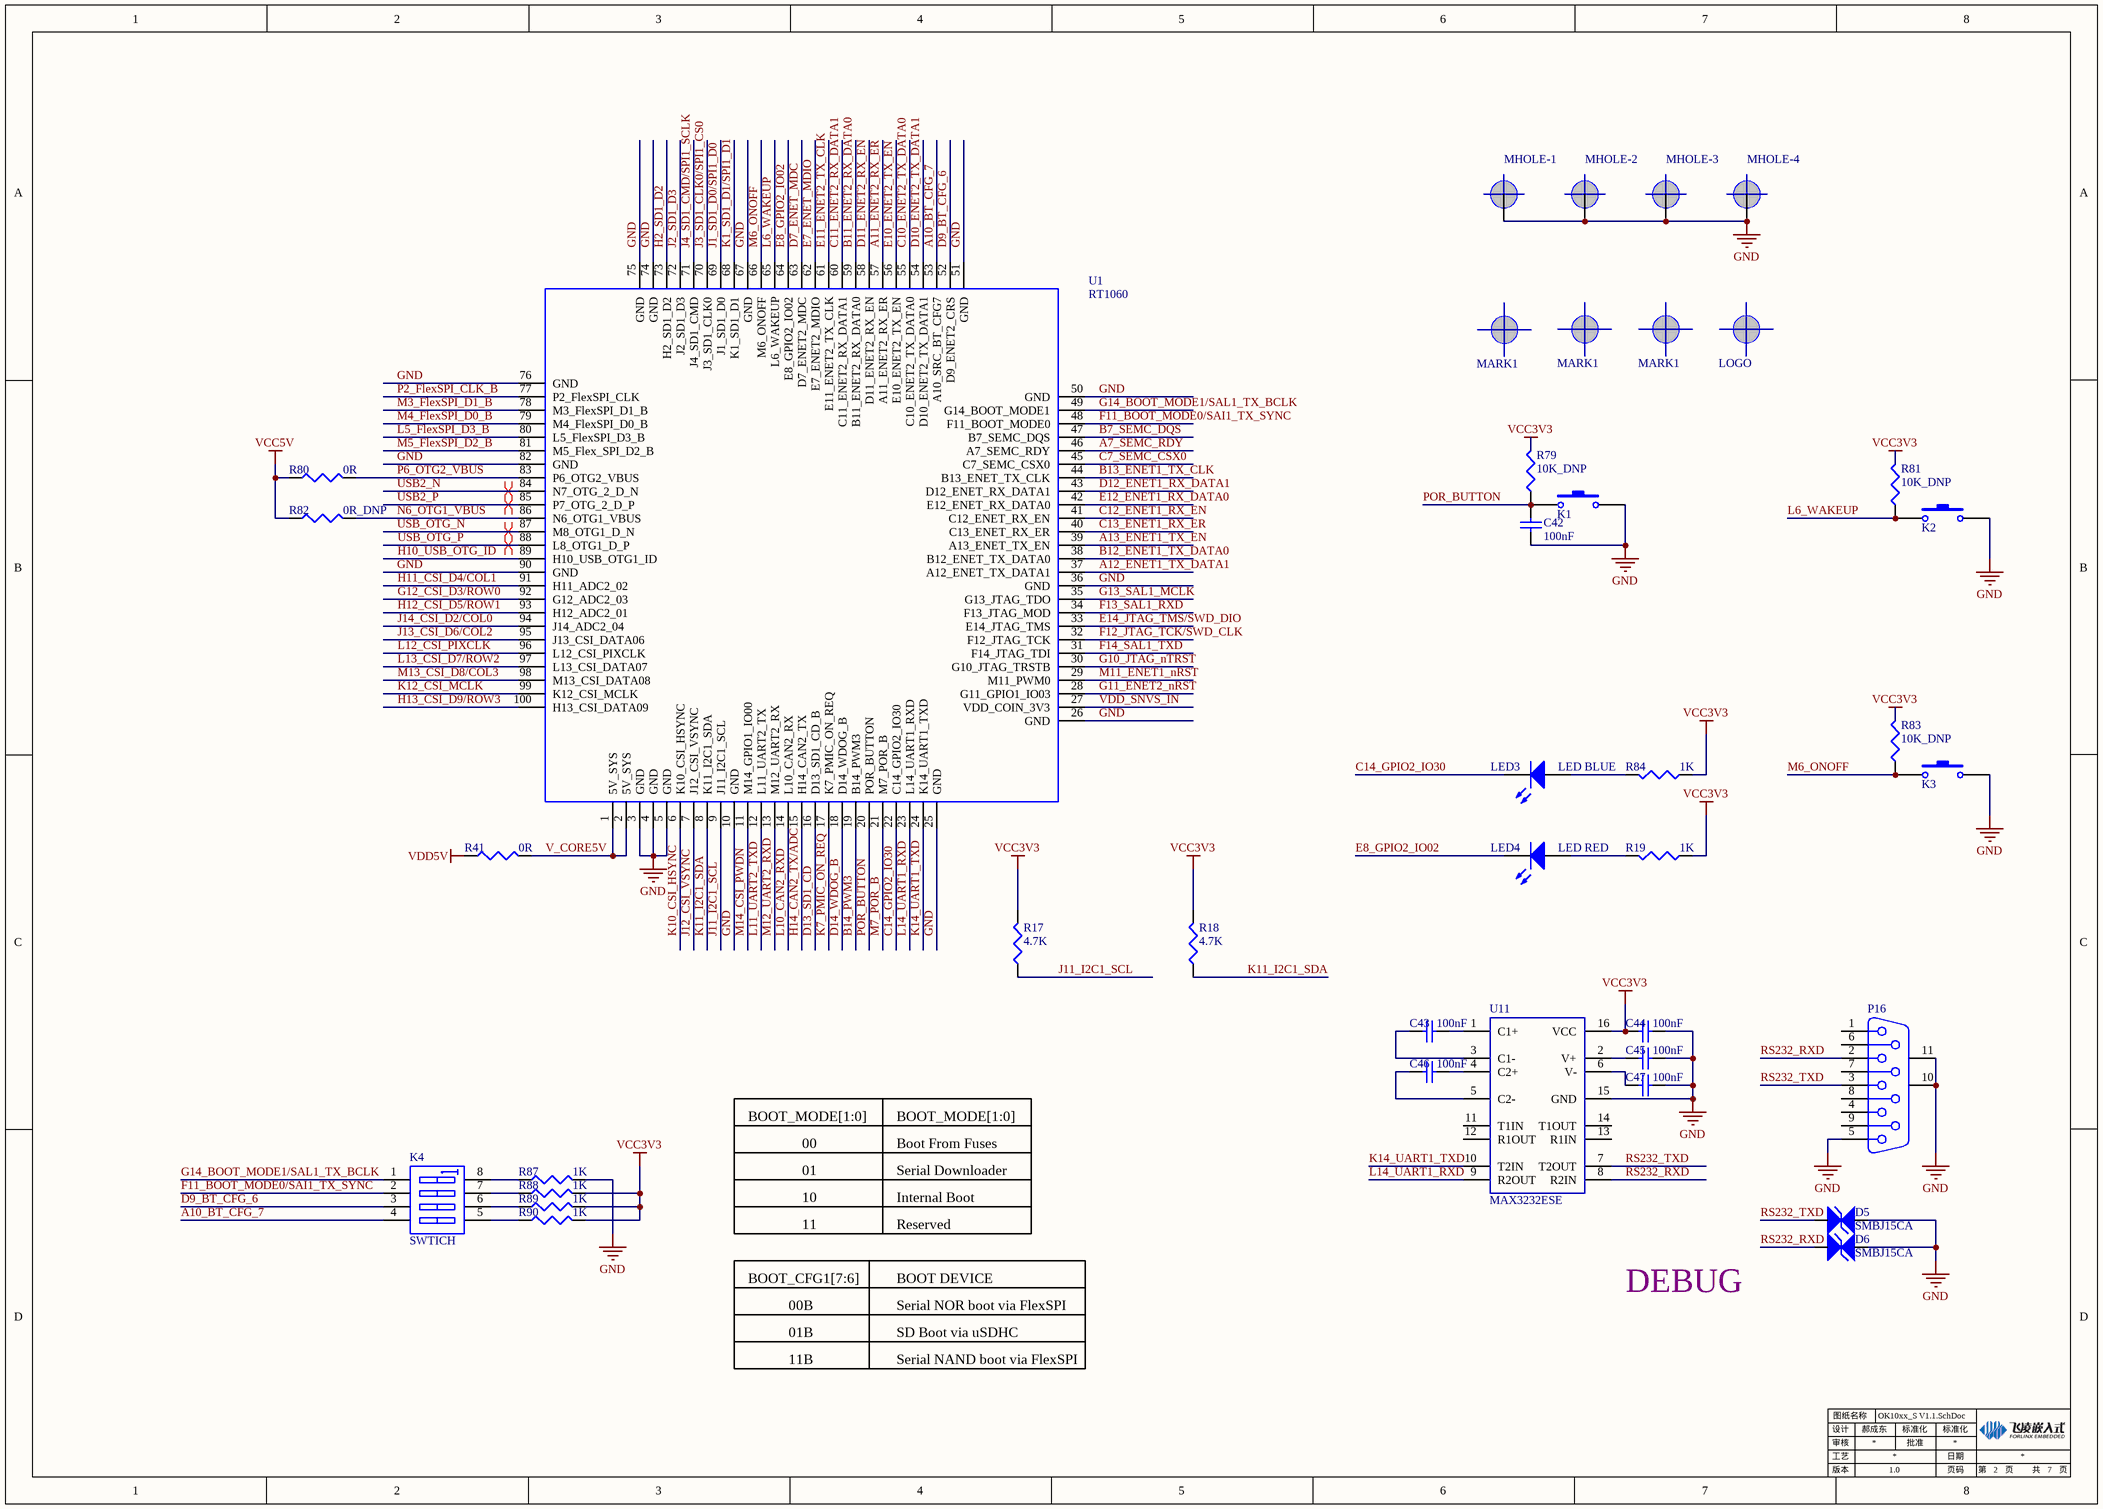
[diagram p4: OK10xx_S V1.1.SchDoc]

### Parts
C42  100nF  [0603C+]
C43  100nF  [0603C+]
C44  100nF  [0603C+]
C45  100nF  [0603C+]
C46  100nF  [0603C+]
C47  100nF  [0603C+]
D5  SMBJ15CA  [SMB/DO-214AA]
D6  SMBJ15CA  [SMB/DO-214AA]
K1  6*6*5侧位2脚带支架  [SW-01]  (value not drawn)
K2  6*6*5侧位2脚带支架  [SW-01]  (value not drawn)
K3  6*6*5侧位2脚带支架  [SW-01]  (value not drawn)
K4  SWTICH  [SMD_4]
LED3  BOOK: LED BLUE  [LED0603_M1608]  (hidden comment: LED_BULE)
LED4  BOOK: LED RED  [LED0603_M1608]  (hidden comment: LED_BULE)
LOGO1  LOGO  [LOGO]
M1  MHOLE-1  [3.2mm_hole]
M2  MHOLE-2  [3.2mm_hole]
M3  MHOLE-3  [3.2mm_hole]
M4  MHOLE-4  [3.2mm_hole]
Mark1  MARK1  [MARK POINT]
Mark2  MARK1  [MARK POINT]
Mark3  MARK1  [MARK POINT]
P16  DEBUG  [DSUB1.385-2H9-M]  (value not drawn)
R17  4.7K  [0603R+]
R18  4.7K  [0603R+]
R19  1K  [0603R+]
R41  0R  [R_1210]
R79  10K_DNP  [0603R+]
R80  0R  [0603R+]
R81  10K_DNP  [0603R+]
R82  0R_DNP  [0603R+]
R83  10K_DNP  [0603R+]
R84  1K  [0603R+]
R87  1K  [0603R+]
R88  1K  [0603R+]
R89  1K  [0603R+]
R90  1K  [0603R+]
U1  RT1060
U11  MAX3232ESE  [SOIC-16N]

### Nets
GND: C42.1 C44.2 C45.2 C47.2 D5.2 D6.2 K1.2 K2.2 K3.2 M1.1(EF) M2.1(EF) M3.1(EF) M4.1(EF) P16.5 P16.10(MH1) P16.11(MH2) R87.2 U1.3(GND) U1.4(GND) U1.5(GND) U1.10(GND) U1.25(GND) U1.26(GND) U1.36(GND) U1.50(GND) U1.51(GND) U1.67(GND) U1.74(GND) U1.75(GND) U1.76(GND) U1.82(GND) U1.90(GND) U11.15(GND)
VCC3V3: C44.1 R17.2 R18.2 R19.1 R79.2 R81.2 R83.2 R84.1 R88.2 R89.2 R90.2 U11.16(VCC)
VCC5V: R80.1 R82.1
VDD5V: R41.1
A7_SEMC_RDY: U1.46(A7_SEMC_RDY)
A10_BT_CFG_7: K4.4(A4) U1.53(A10_SRC_BT_CFG7)
A11_ENET2_RX_ER: U1.57(A11_ENET2_RX_ER)
A12_ENET1_TX_DATA1: U1.37(A12_ENET_TX_DATA1)
A13_ENET1_TX_EN: U1.39(A13_ENET_TX_EN)
B7_SEMC_DQS: U1.47(B7_SEMC_DQS)
B11_ENET2_RX_DATA0: U1.59(B11_ENET2_RX_DATA0)
B12_ENET1_TX_DATA0: U1.38(B12_ENET_TX_DATA0)
B13_ENET1_TX_CLK: U1.44(B13_ENET_TX_CLK)
B14_PWM3: U1.19(B14_PWM3)
C7_SEMC_CSX0: U1.45(C7_SEMC_CSX0)
C10_ENET2_TX_DATA0: U1.55(C10_ENET2_TX_DATA0)
C11_ENET2_RX_DATA1: U1.60(C11_ENET2_RX_DATA1)
C12_ENET1_RX_EN: U1.41(C12_ENET_RX_EN)
C13_ENET1_RX_ER: U1.40(C13_ENET_RX_ER)
C14_GPIO2_IO30: LED3.2(K) U1.22(C14_GPIO2_IO30)
D7_ENET_MDC: U1.63(D7_ENET2_MDC)
D9_BT_CFG_6: K4.3(A3) U1.52(D9_ENET2_CRS)
D10_ENET2_TX_DATA1: U1.54(D10_ENET2_TX_DATA1)
D11_ENET2_RX_EN: U1.58(D11_ENET2_RX_EN)
D12_ENET1_RX_DATA1: U1.43(D12_ENET_RX_DATA1)
D13_SD1_CD: U1.16(D13_SD1_CD_B)
D14_WDOG_B: U1.18(D14_WDOG_B)
E7_ENET_MDIO: U1.62(E7_ENET2_MDIO)
E8_GPIO2_IO02: LED4.2(K) U1.64(E8_GPIO2_IO02)
E10_ENET2_TX_EN: U1.56(E10_ENET2_TX_EN)
E11_ENET2_TX_CLK: U1.61(E11_ENET2_TX_CLK)
E12_ENET1_RX_DATA0: U1.42(E12_ENET_RX_DATA0)
E14_JTAG_TMS/SWD_DIO: U1.33(E14_JTAG_TMS)
F11_BOOT_MODE0/SAI1_TX_SYNC: K4.2(A2) U1.48(F11_BOOT_MODE0)
F12_JTAG_TCK/SWD_CLK: U1.32(F12_JTAG_TCK)
F13_SAL1_RXD: U1.34(F13_JTAG_MOD)
F14_SAL1_TXD: U1.31(F14_JTAG_TDI)
G10_JTAG_nTRST: U1.30(G10_JTAG_TRSTB)
G11_ENET2_nRST: U1.28(G11_GPIO1_IO03)
G12_CSI_D3/ROW0: U1.92(G12_ADC2_03)
G13_SAL1_MCLK: U1.35(G13_JTAG_TDO)
G14_BOOT_MODE1/SAL1_TX_BCLK: K4.1(A1) U1.49(G14_BOOT_MODE1)
H2_SD1_D2: U1.73(H2_SD1_D2)
H10_USB_OTG_ID: U1.89(H10_USB_OTG1_ID)
H11_CSI_D4/COL1: U1.91(H11_ADC2_02)
H12_CSI_D5/ROW1: U1.93(H12_ADC2_01)
H13_CSI_D9/ROW3: U1.100(H13_CSI_DATA09)
H14_CAN2_TX/ADC: U1.15(H14_CAN2_TX)
J1_SD1_D0/SPI1_D0: U1.69(J1_SD1_D0)
J2_SD1_D3: U1.72(J2_SD1_D3)
J3_SD1_CLK0/SPI1_CS0: U1.70(J3_SD1_CLK0)
J4_SD1_CMD/SPI1_SCLK: U1.71(J4_SD1_CMD)
J11_I2C1_SCL: R17.1 U1.9(J11_I2C1_SCL)
J12_CSI_VSYNC: U1.7(J12_CSI_VSYNC)
J13_CSI_D6/COL2: U1.95(J13_CSI_DATA06)
J14_CSI_D2/COL0: U1.94(J14_ADC2_04)
K1_SD1_D1/SPI1_D1: U1.68(K1_SD1_D1)
K7_PMIC_ON_REQ: U1.17(K7_PMIC_ON_REQ)
K10_CSI_HSYNC: U1.6(K10_CSI_HSYNC)
K11_I2C1_SDA: R18.1 U1.8(K11_I2C1_SDA)
K12_CSI_MCLK: U1.99(K12_CSI_MCLK)
K14_UART1_TXD: U1.24(K14_UART1_TXD) U11.10(T2IN)
L5_FlexSPI_D3_B: U1.80(L5_FlexSPI_D3_B)
L6_WAKEUP: K2.1 R81.1 U1.65(L6_WAKEUP)
L10_CAN2_RXD: U1.14(L10_CAN2_RX)
L11_UART2_TXD: U1.12(L11_UART2_TX)
L12_CSI_PIXCLK: U1.96(L12_CSI_PIXCLK)
L13_CSI_D7/ROW2: U1.97(L13_CSI_DATA07)
L14_UART1_RXD: U1.23(L14_UART1_RXD) U11.9(R2OUT)
M3_FlexSPI_D1_B: U1.78(M3_FlexSPI_D1_B)
M4_FlexSPI_D0_B: U1.79(M4_FlexSPI_D0_B)
M5_FlexSPI_D2_B: U1.81(M5_Flex_SPI_D2_B)
M6_ONOFF: K3.1 R83.1 U1.66(M6_ONOFF)
M7_POR_B: U1.21(M7_POR_B)
M11_ENET1_nRST: U1.29(M11_PWM0)
M12_UART2_RXD: U1.13(M12_UART2_RX)
M13_CSI_D8/COL3: U1.98(M13_CSI_DATA08)
M14_CSI_PWDN: U1.11(M14_GPIO1_IO00)
N6_OTG1_VBUS: R82.2 U1.86(N6_OTG1_VBUS)
P2_FlexSPI_CLK_B: U1.77(P2_FlexSPI_CLK)
P6_OTG2_VBUS: R80.2 U1.83(P6_OTG2_VBUS)
POR_BUTTON: C42.2 K1.1 R79.1 U1.20(POR_BUTTON)
RS232_RXD: D6.1 P16.2 U11.8(R2IN)
RS232_TXD: D5.1 P16.3 U11.7(T2OUT)
USB2_N: U1.84(N7_OTG_2_D_N)
USB2_P: U1.85(P7_OTG_2_D_P)
USB_OTG_N: U1.87(M8_OTG1_D_N)
USB_OTG_P: U1.88(L8_OTG1_D_P)
V_CORE5V: R41.2 U1.1(5V_SYS) U1.2(5V_SYS)
VDD_SNVS_IN: U1.27(VDD_COIN_3V3)
NetC43_1: C43.1 U11.3(C1-)
NetC43_2: C43.2 U11.1(C1+)
NetC45_1: C45.1 U11.2(V+)
NetC46_1: C46.1 U11.5(C2-)
NetC46_2: C46.2 U11.4(C2+)
NetC47_1: C47.1 U11.6(V-)
NetK4_5: K4.5(B4) R90.1
NetK4_6: K4.6(B3) R89.1
NetK4_7: K4.7(B2) R88.1
NetK4_8: K4.8(B1) R87.1
NetLED3_1: LED3.1(A) R84.2
NetLED4_1: LED4.1(A) R19.2

Not connected (* = marked no-connect by the designer): P16 1 4 6 7 8 9; U11 11(T1IN) 12(R1OUT) 13(R1IN) 14(T1OUT)

### Layout directives
differential pair: USB2_N, USB2_P, USB_OTG_N, USB_OTG_P

### Notes on the sheet
- BOOT_MODE[1:0]
- 00
- 01
- Boot From Fuses
- Serial Downloader
- 10
- 11
- Internal Boot
- Reserved
- BOOT_CFG1[7:6]
- 00B
- BOOT DEVICE
- Serial NOR boot via FlexSPI
- DEBUG
- 01B
- 11B
- SD Boot via uSDHC
- Serial NAND boot via FlexSPI
- 设计
- 审核
- 工艺
- 图纸名称
- 郝成东
- 批准
- 标准化
- 日期
- 版本
- 页码
- 第
- 页
- 共

### Library data of the parts
C42-C47 = Cap: Capacitor; Published: 8-Jun-2000; LatestRevisionDate: 17-Jul-2002; LatestRevisionNote: Re-released for DXP Platform.; PackageReference: RAD-0.3; Publisher: Altium Limited; PackageDescription: Radial Cap, Thru-Hole; 2 Leads; 0.3 in Pin Spacing; Value: 100nF
D5 D6 = TVS: Value: SMBJ15CA
K1-K3 = SW-PB: Switch; Published: 24-Mar-1999; LatestRevisionDate: 17-Jul-2002; LatestRevisionNote: Re-released for DXP Platform.; PackageReference: SPST-2; Publisher: Altium Limited
K4 = SWTICH_DIP6
LED3 LED4 = LED2: as LED1 on sheet POWER&RTC; Published: 8-Jun-2000; LatestRevisionDate: 17-Jul-2002; LatestRevisionNote: Re-released for DXP Platform.; PackageDocument: Feb-2002; PackageReference: 3.2X1.6X1.1; Publisher: Altium Limited
LOGO1 = MHOLE_1
M1 M3 M4 = MHOLE-2
Mark1-Mark3 = MHOLE
P16 = D Connector 9: Receptacle Assembly, 9 Position, Right Angle; PackageDocument: O; Positions: 9; Published: 15-Jun-2001; LatestRevisionDate: 17-Jul-2002; LatestRevisionNote: Re-released for DXP Platform.; DatasheetDocument: 1-Sep-1999; PackageReference: 788750; Publisher: Altium Limited; Orientation: Right Angle; Gender: Receptacle
R17-R19 R41 R79-R84 R87-R90 = Res3: Resistor; Published: 8-Jun-2000; LatestRevisionDate: 29-May-2009; LatestRevisionNote: IPC-7351 Footprint Added.; PackageReference: J1-0603; Publisher: Altium Limited; PackageDescription: Chip Resistor
  R17 R18: Value: 4.7K
  R19 R84 R87-R90: Value: 1K
  R41 R80: Value: 0R
  R79 R81 R83: Value: 10K_DNP
  R82: Value: 0R_DNP
U11 = MAX3232

## Sheet TF_CARD&USB.SchDoc
size A3; Revision: 1.0; SheetNumber: 6; SheetTotal: 7
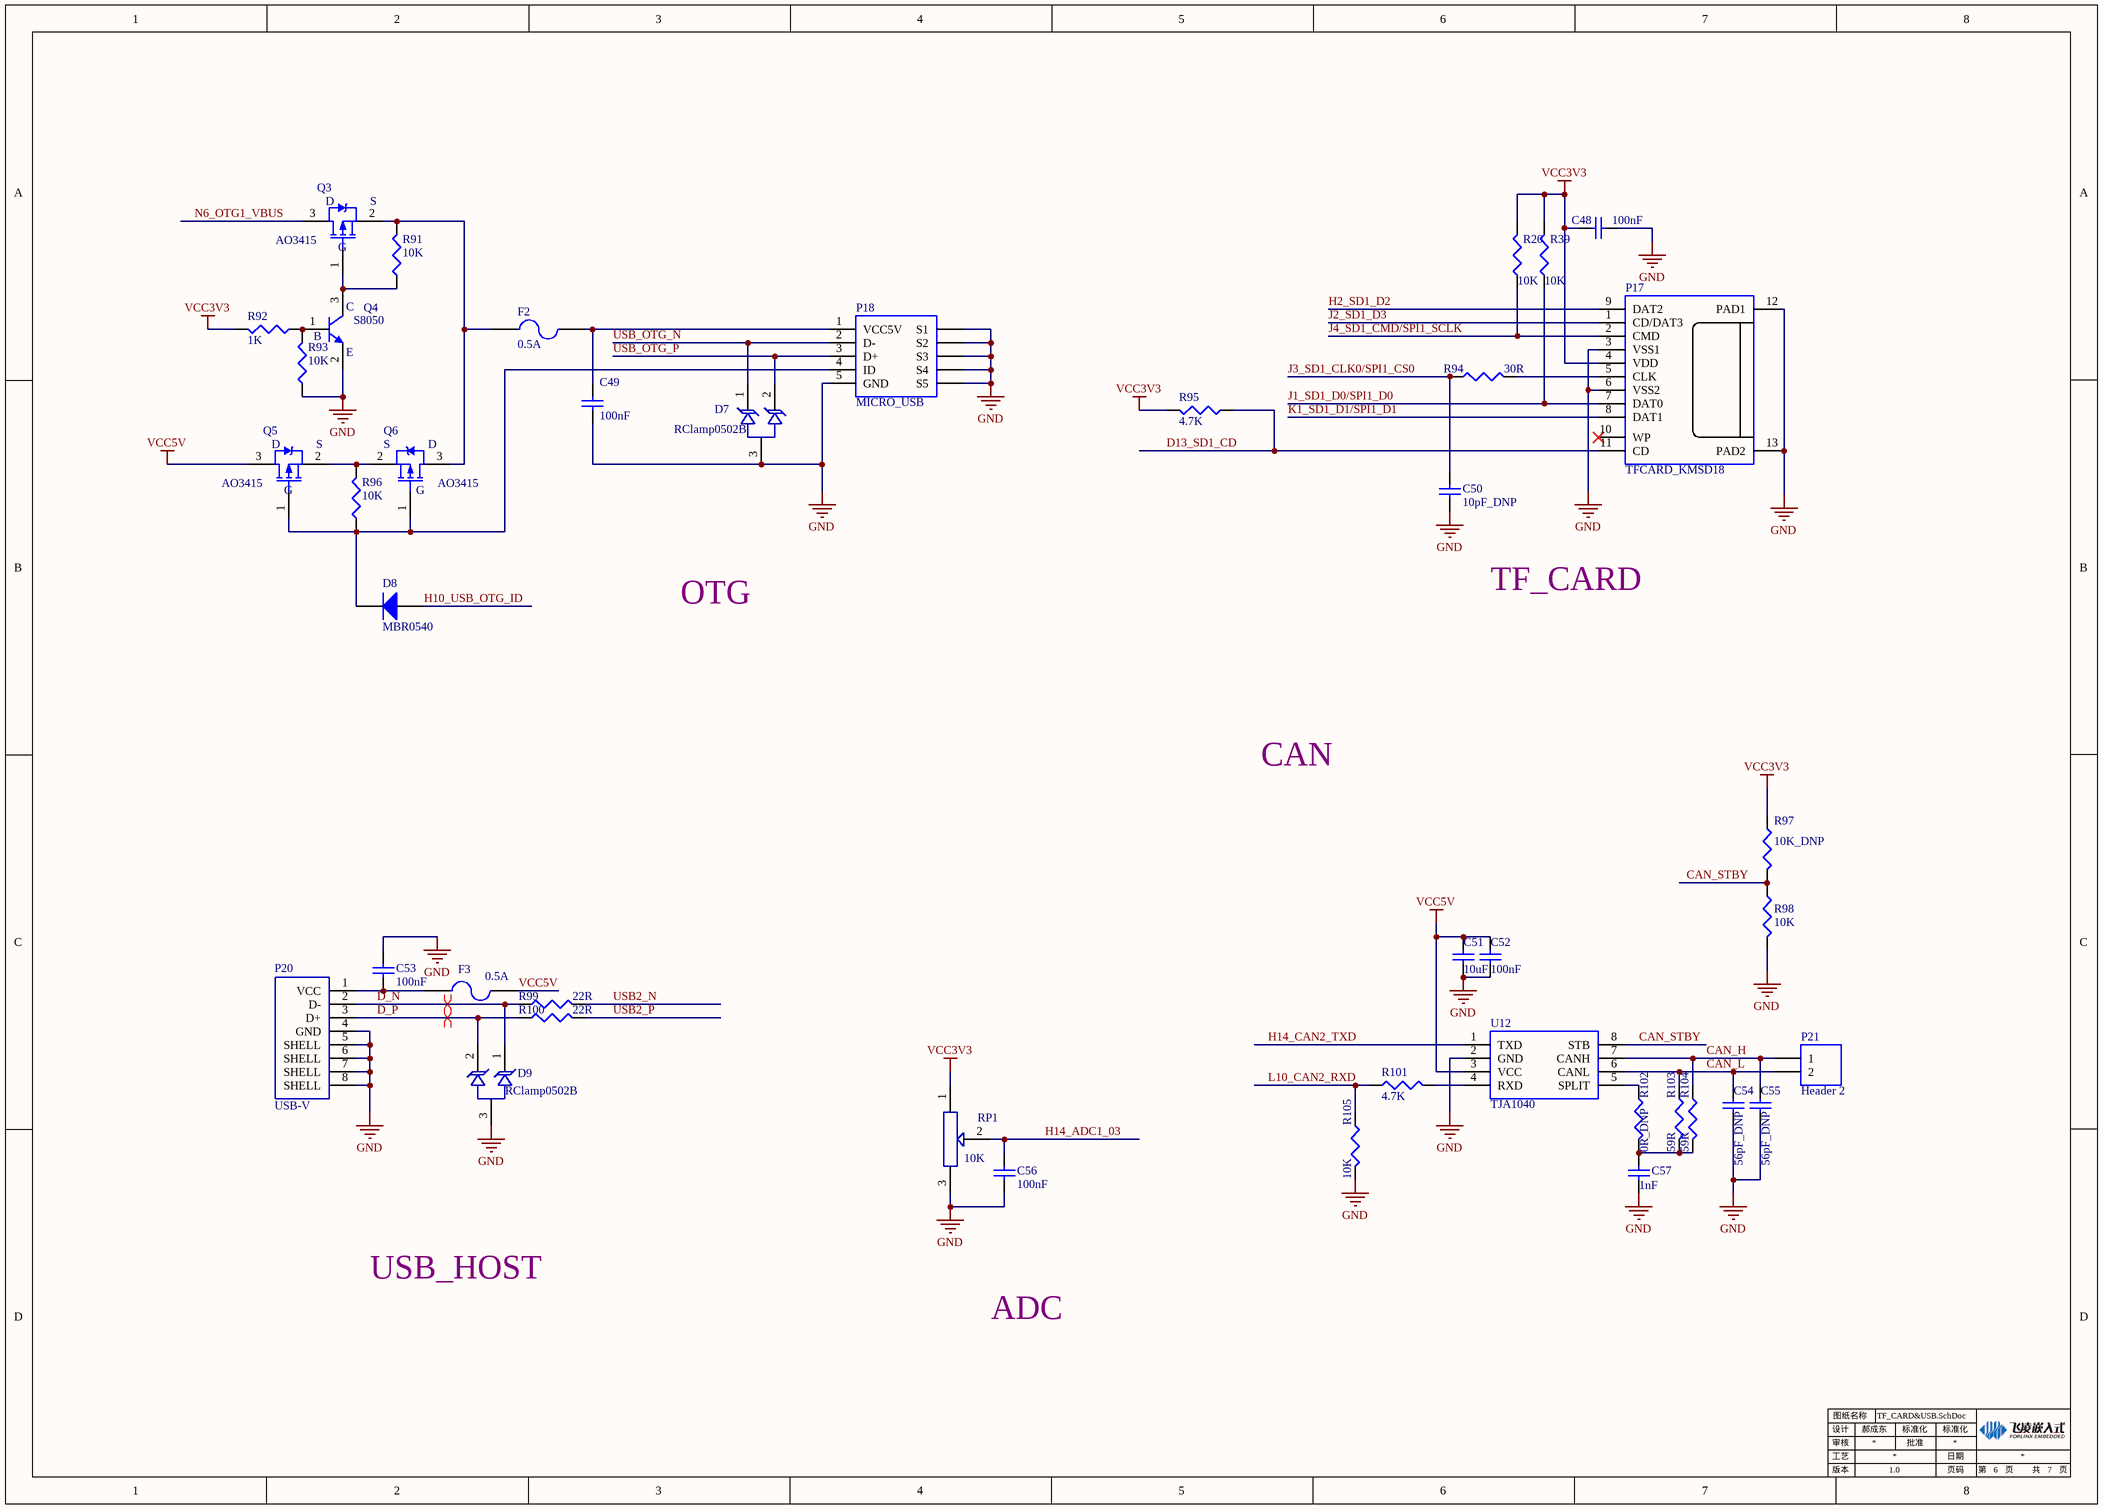
[diagram p5: TF_CARD&USB.SchDoc]

### Parts
C48  100nF  [0603C+]
C49  100nF  [0603C+]
C50  10pF_DNP  [0603C+]
C51  10uF  [0603C+]
C52  100nF  [0603C+]
C53  100nF  [0603C+]
C54  56pF_DNP  [0603C+]
C55  56pF_DNP  [0603C+]
C56  100nF  [0603C+]
C57  1nF  [0603C+]
D7  RClamp0502B  [SOT-523]
D8  MBR0540  [Diode1.6*2.6]
D9  RClamp0502B  [SOT-523]
F2  0.5A  [R_1210]
F3  0.5A  [R_1210]
P17  TFCARD_KMSD18  [TF-CARD]
P18  MICRO_USB  [microUSB]
P20  USB-V  [USB-C]
P21  Header 2  [DG128-2P]
Q3  AO3415  [SOT95P245X110-3N]
Q4  S8050  [SOT95P245X110-3N]
Q5  AO3415  [SOT95P245X110-3N]
Q6  AO3415  [SOT95P245X110-3N]
R20  10K  [0603R+]
R39  10K  [0603R+]
R91  10K  [0603R+]
R92  1K  [0603R+]
R93  10K  [0603R+]
R94  30R  [0603R+]
R95  4.7K  [0603R+]
R96  10K  [0603R+]
R97  10K_DNP  [0603R+]
R98  10K  [0603R+]
R99  22R  [0603R+]
R100  22R  [0603R+]
R101  4.7K  [0603R+]
R102  0R_DNP  [0603R+]
R103  59R  [0603R+]
R104  59R  [0603R+]
R105  10K  [0603R+]
RP1  value 10K  [3296W]  (hidden comment: VR-3296W)
U12  TJA1040  [SOP127P600X175-8N]

### Nets
GND: C48.1 C49.1 C50.2 C51.2 C52.2 C53.1 C54.2 C55.2 C56.1 C57.2 D7.3 D9.3 P17.3(VSS1) P17.6(VSS2) P17.12(PAD1) P17.13(PAD2) P18.5(GND) P18.6(S1) P18.7(S2) P18.8(S3) P18.9(S4) P18.10(S5) P20.4(GND) P20.5(SHELL) P20.6(SHELL) P20.7(SHELL) P20.8(SHELL) Q4.2(E) R93.1 R98.2 R105.2 RP1.3(VCC) U12.2(GND)
VCC3V3: C48.2 P17.4(VDD) R20.2 R39.2 R92.2 R95.2 R97.1 RP1.1(VCC)
VCC5V: C51.1 C52.1 F3.1 Q5.3(D) U12.3(VCC)
CAN_H: C55.1 P21.1 R104.1 U12.7(CANH)
CAN_L: C54.1 P21.2 R103.1 U12.6(CANL)
CAN_STBY: R97.2 R98.1 U12.8(STB)
D13_SD1_CD: P17.11(CD) R95.1
D_N: D9.1 P20.2(D-) R99.1
D_P: D9.2 P20.3(D+) R100.1
H2_SD1_D2: P17.9(DAT2)
H10_USB_OTG_ID: D8.1(A)
H14_ADC1_03: C56.2 RP1.2(VCC)
H14_CAN2_TXD: U12.1(TXD)
J1_SD1_D0/SPI1_D0: P17.7(DAT0) R39.1
J2_SD1_D3: P17.1(CD/DAT3)
J3_SD1_CLK0/SPI1_CS0: C50.1 R94.1
J4_SD1_CMD/SPI1_SCLK: P17.2(CMD) R20.1
K1_SD1_D1/SPI1_D1: P17.8(DAT1)
L10_CAN2_RXD: R101.1 R105.1
N6_OTG1_VBUS: Q3.3(D)
USB2_N: R99.2
USB2_P: R100.2
USB_OTG_N: D7.1 P18.2(D-)
USB_OTG_P: D7.2 P18.3(D+)
NetC49_2: C49.2 F2.1 P18.1(VCC5V)
NetC53_2: C53.2 F3.2 P20.1(VCC)
NetC57_1: C57.1 R102.2 R103.2 R104.2
NetD8_2: D8.2(K) P18.4(ID) Q5.1(G) Q6.1(G) R96.1
NetF2_2: F2.2 Q3.2(S) Q6.3(D) R91.2
NetP17_5: P17.5(CLK) R94.2
NetQ3_1: Q3.1(G) Q4.3(C) R91.1
NetQ4_1: Q4.1(B) R92.1 R93.2
NetQ5_2: Q5.2(S) Q6.2(S) R96.2
NetR101_2: R101.2 U12.4(RXD)
NetR102_1: R102.1 U12.5(SPLIT)

Not connected (* = marked no-connect by the designer): P17 10(WP)*

### Layout directives
differential pair: D_N, D_P

### Notes on the sheet
- OTG
- TF_CARD
- CAN
- USB_HOST
- ADC
- 设计
- 审核
- 工艺
- 图纸名称
- 郝成东
- 批准
- 标准化
- 日期
- 版本
- 页码
- 第
- 页
- 共

### Library data of the parts
C48-C57 = Cap: Capacitor; Published: 8-Jun-2000; LatestRevisionDate: 17-Jul-2002; LatestRevisionNote: Re-released for DXP Platform.; PackageReference: RAD-0.3; Publisher: Altium Limited; PackageDescription: Radial Cap, Thru-Hole; 2 Leads; 0.3 in Pin Spacing
  C48 C49 C52 C53 C56: Value: 100nF
  C50: Value: 10pF_DNP
  C51: Value: 10uF
  C54 C55: Value: 56pF_DNP
  C57: Value: 1nF
D7 D9 = LCTVS: Value: RClamp0502B
D8 = Diode: Default Diode; Published: 8-Jun-2000; LatestRevisionDate: 17-Jul-2002; LatestRevisionNote: Re-released for DXP Platform.; PackageVersion: Sep-1996; PackageReference: SMC; Publisher: Altium Limited; PackageDescription: DO-214-AB/SMC; 2 C-Bend Leads; Body 7.9 x 5.9 mm, inc. leads (LxW); Code_JEDEC: DO-214-AB
F2 F3 = Fuse 2: Fuse; Published: 8-Jun-2000; LatestRevisionDate: 17-Jul-2002; LatestRevisionNote: Re-released for DXP Platform.; PackageReference: PIN-W2/E2.8; Publisher: Altium Limited; PackageDescription: Thru-Hole; 2 Leads; Value: 0.5A
P17 = SDCARD_KMSD18
P18 = MICRO_USB: Header, 5-Pin, Dual row; LatestRevisionDate: 17-Jul-2002; LatestRevisionNote: Re-released for DXP Platform.; Publisher: Altium Limited; VALUE: MICRO_USB
Q3 Q5 Q6 = PMOS: N-Channel Power MOSFET; Note: Pin 2 is electrically connected to pin 4.; Published: 8-Jun-2000; LatestRevisionDate: 17-Jul-2002; LatestRevisionNote: Re-released for DXP Platform.; DatasheetVersion: PD-9.814; PackageVersion: Feb-1997; PackageReference: TO-220AB; Publisher: Altium Limited; PackageDescription: TO, Thru-Hole, Vertical, Heatsink Mounted; 3 In-Line Leads; Pitch 2.54 mm; ComponentLink1Description: Manufacturer Link; ComponentLink1URL: http://www.irf.com/; VALUE: AO3415
Q4 = NPN: NPN Bipolar Transistor; Published: 8-Jun-2000; LatestRevisionDate: 17-Jul-2002; LatestRevisionNote: Re-released for DXP Platform.; PackageReference: TO-226-AA; Publisher: Altium Limited; PackageDescription: TO, Flat Index; 3 In-Line, Axial Leads; Body Dia. 4.8mm; Leads 0.55 x 0.51 mm (max); Code_JEDEC: TO-226-AA; VALUE: S8050
R20 R39 R91-R105 = Res3: Resistor; Published: 8-Jun-2000; LatestRevisionDate: 29-May-2009; LatestRevisionNote: IPC-7351 Footprint Added.; PackageReference: J1-0603; Publisher: Altium Limited; PackageDescription: Chip Resistor
  R20 R39 R91 R93 R96 R98 R105: Value: 10K
  R92: Value: 1K
  R94: Value: 30R
  R95 R101: Value: 4.7K
  R97: Value: 10K_DNP
  R99 R100: Value: 22R
  R102: Value: 0R_DNP
  R103 R104: Value: 59R
RP1 = VR

## Sheet Camera.SchDoc
size A3; Revision: 1.0; SheetNumber: 7; SheetTotal: 7
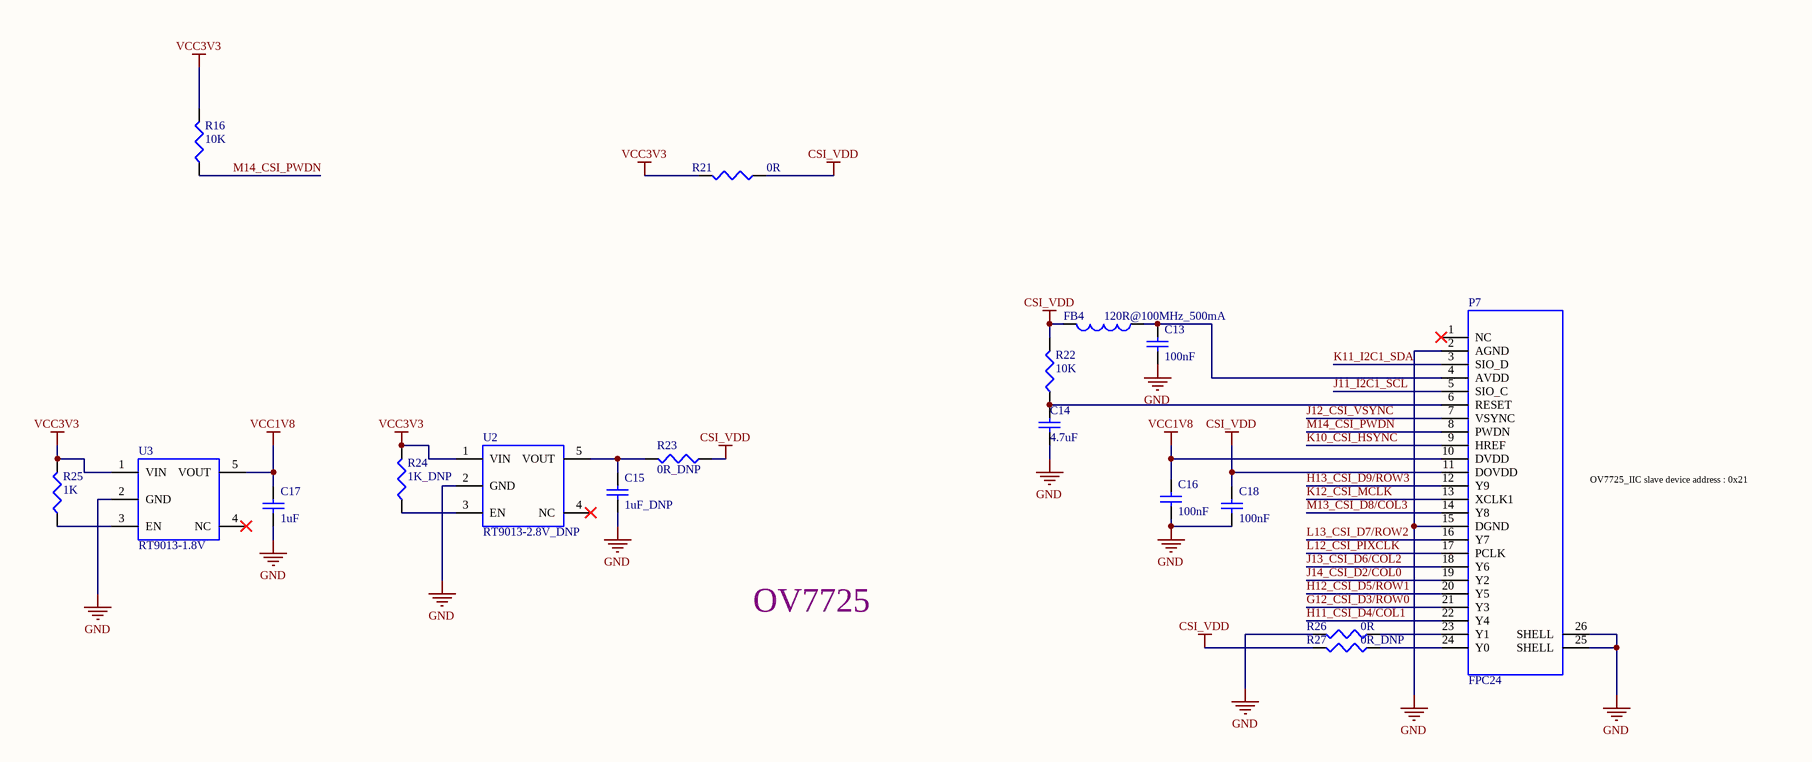
[diagram p6: Camera.SchDoc]

### Parts
C13  100nF  [0603C+]
C14  value 4.7uF  [0603C+]  (hidden comment: 0.1uF)
C15  1uF_DNP  [0603C+]
C16  value 100nF  [0603C+]  (hidden comment: 0.1uF)
C17  1uF  [0603C+]
C18  100nF  [0603C+]
FB4  120R@100MHz_500mA  [0603R+]
P7  FPC24  [FPC24]
R16  10K  [0603R+]
R21  0R  [0603R+]
R22  10K  [0603R+]
R23  0R_DNP  [0603R+]
R24  1K_DNP  [0603R+]
R25  1K  [0603R+]
R26  0R  [0603R+]
R27  0R_DNP  [0603R+]
U2  RT9013-2.8V_DNP  [SOT95P280X129-5N]
U3  RT9013-1.8V  [SOT95P280X129-5N]

### Nets
CSI_VDD: C18.1 FB4.2 P7.11(DOVDD) R21.1 R22.2 R23.1 R27.2
GND: C13.2 C14.2 C15.1 C16.2 C17.1 C18.2 P7.2(AGND) P7.15(DGND) P7.25(SHELL) P7.26(SHELL) R26.2 U2.2(GND) U3.2(GND)
VCC1V8: C16.1 C17.2 P7.10(DVDD) U3.5(VOUT)
VCC3V3: R16.2 R21.2 R24.2 R25.2 U2.1(VIN) U3.1(VIN)
G12_CSI_D3/ROW0: P7.21(Y3)
H11_CSI_D4/COL1: P7.22(Y4)
H12_CSI_D5/ROW1: P7.20(Y5)
H13_CSI_D9/ROW3: P7.12(Y9)
J11_I2C1_SCL: P7.5(SIO_C)
J12_CSI_VSYNC: P7.7(VSYNC)
J13_CSI_D6/COL2: P7.18(Y6)
J14_CSI_D2/COL0: P7.19(Y2)
K10_CSI_HSYNC: P7.9(HREF)
K11_I2C1_SDA: P7.3(SIO_D)
K12_CSI_MCLK: P7.13(XCLK1)
L12_CSI_PIXCLK: P7.17(PCLK)
L13_CSI_D7/ROW2: P7.16(Y7)
M13_CSI_D8/COL3: P7.14(Y8)
M14_CSI_PWDN: P7.8(PWDN) R16.1
NetC13_1: C13.1 FB4.1 P7.4(AVDD)
NetC14_1: C14.1 P7.6(RESET) R22.1
NetC15_2: C15.2 R23.2 U2.5(VOUT)
NetP7_23: P7.23(Y1) R26.1
NetP7_24: P7.24(Y0) R27.1
NetR24_1: R24.1 U2.3(EN)
NetR25_1: R25.1 U3.3(EN)

Not connected (* = marked no-connect by the designer): P7 1(NC)*; U2 4(NC)*; U3 4(NC)*

### Notes on the sheet
- (near P7) OV7725_IIC slave device address : 0x21
- OV7725
- 设计
- 审核
- 工艺
- 图纸名称
- 郝成东
- 批准
- 标准化
- 日期
- 版本
- 页码
- 第
- 页
- 共

### Library data of the parts
C13-C18 = Cap: Capacitor; Published: 8-Jun-2000; LatestRevisionDate: 17-Jul-2002; LatestRevisionNote: Re-released for DXP Platform.; PackageReference: RAD-0.3; Publisher: Altium Limited; PackageDescription: Radial Cap, Thru-Hole; 2 Leads; 0.3 in Pin Spacing
  C13 C18: Value: 100nF
  C15: Value: 1uF_DNP
  C17: Value: 1uF
FB4 = Inductor: Code_IEC: 1005; Published: 8-Jun-2000; LatestRevisionDate: 29-May-2009; LatestRevisionNote: IPC-7351 Footprint Added.; PackageReference: 0402-A; Publisher: Altium Limited; PackageDescription: Chip Inductor; Code_JEITA: 0402; Value: 120R@100MHz_500mA
P7 = CON24
R16 R21-R27 = Res3: Resistor; Published: 8-Jun-2000; LatestRevisionDate: 29-May-2009; LatestRevisionNote: IPC-7351 Footprint Added.; PackageReference: J1-0603; Publisher: Altium Limited; PackageDescription: Chip Resistor
  R16 R22: Value: 10K
  R21 R26: Value: 0R
  R23 R27: Value: 0R_DNP
  R24: Value: 1K_DNP
  R25: Value: 1K
U2 U3 = RT9013

## Nets that join several sheets
GND: POWER&RTC (34 pins), NET (38 pins), AUDIO (23 pins), OK10xx_S V1.1 (33 pins), TF_CARD&USB (33 pins), Camera (13 pins)
VCC3V3: POWER&RTC (10 pins), NET (26 pins), AUDIO (FB1.2 R1.1), OK10xx_S V1.1 (12 pins), TF_CARD&USB (8 pins), Camera (6 pins)
VCC5V: POWER&RTC (8 pins), AUDIO (P4.5 P4.6 P6.5 P6.6), OK10xx_S V1.1 (R80.1 R82.1), TF_CARD&USB (5 pins)
VDD5V: POWER&RTC (14 pins), OK10xx_S V1.1 (R41.1)
A7_SEMC_RDY: POWER&RTC (P13.3), OK10xx_S V1.1 (U1.46)
A10_BT_CFG_7: POWER&RTC (P12.15), OK10xx_S V1.1 (K4.4 U1.53)
A11_ENET2_RX_ER: POWER&RTC (P12.17), NET (R57.2 R59.2 U5.20), OK10xx_S V1.1 (U1.57)
A12_ENET1_TX_DATA1: POWER&RTC (P13.20), NET (U4.25), OK10xx_S V1.1 (U1.37)
A13_ENET1_TX_EN: POWER&RTC (P13.21), NET (U4.23), OK10xx_S V1.1 (U1.39)
B7_SEMC_DQS: POWER&RTC (P13.25), OK10xx_S V1.1 (U1.47)
B11_ENET2_RX_DATA0: POWER&RTC (P12.18), NET (R45.1 U5.16), OK10xx_S V1.1 (U1.59)
B12_ENET1_TX_DATA0: POWER&RTC (P13.7), NET (U4.24), OK10xx_S V1.1 (U1.38)
B13_ENET1_TX_CLK: POWER&RTC (P13.4), NET (U4.9), OK10xx_S V1.1 (U1.44)
B14_PWM3: POWER&RTC (P14.24), OK10xx_S V1.1 (U1.19)
C7_SEMC_CSX0: POWER&RTC (P13.24), OK10xx_S V1.1 (U1.45)
C10_ENET2_TX_DATA0: POWER&RTC (P12.16), NET (U5.24), OK10xx_S V1.1 (U1.55)
C11_ENET2_RX_DATA1: POWER&RTC (P12.8), NET (R51.1 U5.15), OK10xx_S V1.1 (U1.60)
C12_ENET1_RX_EN: POWER&RTC (P13.22), NET (R64.2 U4.18), OK10xx_S V1.1 (U1.41)
C13_ENET1_RX_ER: POWER&RTC (P13.6), NET (R56.1 R58.2 U4.20), OK10xx_S V1.1 (U1.40)
C14_GPIO2_IO30: POWER&RTC (P14.25), OK10xx_S V1.1 (LED3.2 U1.22)
D7_ENET_MDC: POWER&RTC (P12.7), NET (R40.1 U4.12 U5.12), OK10xx_S V1.1 (U1.63)
D9_BT_CFG_6: POWER&RTC (P12.12), OK10xx_S V1.1 (K4.3 U1.52)
D10_ENET2_TX_DATA1: POWER&RTC (P12.11), NET (U5.25), OK10xx_S V1.1 (U1.54)
D11_ENET2_RX_EN: POWER&RTC (P12.9), NET (R65.2 U5.18), OK10xx_S V1.1 (U1.58)
D12_ENET1_RX_DATA1: POWER&RTC (P13.23), NET (R50.2 U4.15), OK10xx_S V1.1 (U1.43)
D13_SD1_CD: POWER&RTC (P14.5), OK10xx_S V1.1 (U1.16), TF_CARD&USB (P17.11 R95.1)
D14_WDOG_B: POWER&RTC (P14.4), OK10xx_S V1.1 (U1.18)
E7_ENET_MDIO: POWER&RTC (P12.20), NET (R38.1 U4.11 U5.11), OK10xx_S V1.1 (U1.62)
E8_GPIO2_IO02: POWER&RTC (P12.6), OK10xx_S V1.1 (LED4.2 U1.64)
E10_ENET2_TX_EN: POWER&RTC (P12.10), NET (U5.23), OK10xx_S V1.1 (U1.56)
E11_ENET2_TX_CLK: POWER&RTC (P12.19), NET (U5.9), OK10xx_S V1.1 (U1.61)
E12_ENET1_RX_DATA0: POWER&RTC (P13.5), NET (R44.1 U4.16), OK10xx_S V1.1 (U1.42)
E14_JTAG_TMS/SWD_DIO: POWER&RTC (P13.18), OK10xx_S V1.1 (U1.33)
F11_BOOT_MODE0/SAI1_TX_SYNC: POWER&RTC (P13.2), AUDIO (R2.2), OK10xx_S V1.1 (K4.2 U1.48)
F12_JTAG_TCK/SWD_CLK: POWER&RTC (P13.17), OK10xx_S V1.1 (U1.32)
F13_SAL1_RXD: POWER&RTC (P13.8 R15.1), OK10xx_S V1.1 (U1.34)
F14_SAL1_TXD: POWER&RTC (P13.10), AUDIO (R4.2), OK10xx_S V1.1 (U1.31)
G10_JTAG_nTRST: POWER&RTC (P13.14), OK10xx_S V1.1 (U1.30)
G11_ENET2_nRST: POWER&RTC (P13.12), NET (R31.2), OK10xx_S V1.1 (U1.28)
G12_CSI_D3/ROW0: POWER&RTC (P22.1), OK10xx_S V1.1 (U1.92), Camera (P7.21)
G13_SAL1_MCLK: POWER&RTC (P13.19), AUDIO (R5.2), OK10xx_S V1.1 (U1.35)
G14_BOOT_MODE1/SAL1_TX_BCLK: POWER&RTC (P13.26), AUDIO (R3.2), OK10xx_S V1.1 (K4.1 U1.49)
H2_SD1_D2: POWER&RTC (P12.26), OK10xx_S V1.1 (U1.73), TF_CARD&USB (P17.9)
H10_USB_OTG_ID: OK10xx_S V1.1 (U1.89), TF_CARD&USB (D8.1)
H11_CSI_D4/COL1: POWER&RTC (P22.2), OK10xx_S V1.1 (U1.91), Camera (P7.22)
H12_CSI_D5/ROW1: POWER&RTC (P22.4), OK10xx_S V1.1 (U1.93), Camera (P7.20)
H13_CSI_D9/ROW3: POWER&RTC (P22.7), OK10xx_S V1.1 (U1.100), Camera (P7.12)
H14_ADC1_03: POWER&RTC (P14.21), TF_CARD&USB (C56.2 RP1.2)
H14_CAN2_TX/ADC: POWER&RTC (P14.22), OK10xx_S V1.1 (U1.15)
H14_CAN2_TXD: POWER&RTC (P14.23), TF_CARD&USB (U12.1)
J1_SD1_D0/SPI1_D0: POWER&RTC (P12.24), AUDIO (P6.8), OK10xx_S V1.1 (U1.69), TF_CARD&USB (P17.7 R39.1)
J2_SD1_D3: POWER&RTC (P12.2), OK10xx_S V1.1 (U1.72), TF_CARD&USB (P17.1)
J3_SD1_CLK0/SPI1_CS0: POWER&RTC (P12.3), AUDIO (P6.3), OK10xx_S V1.1 (U1.70), TF_CARD&USB (C50.1 R94.1)
J4_SD1_CMD/SPI1_SCLK: POWER&RTC (P12.25), AUDIO (P6.1), OK10xx_S V1.1 (U1.71), TF_CARD&USB (P17.2 R20.1)
J11_I2C1_SCL: POWER&RTC (P14.18 U9.6 U10.6), AUDIO (U13.17), OK10xx_S V1.1 (R17.1 U1.9), Camera (P7.5)
J12_CSI_VSYNC: POWER&RTC (P14.17), OK10xx_S V1.1 (U1.7), Camera (P7.7)
J13_CSI_D6/COL2: POWER&RTC (P22.6), OK10xx_S V1.1 (U1.95), Camera (P7.18)
J14_CSI_D2/COL0: POWER&RTC (P22.3), OK10xx_S V1.1 (U1.94), Camera (P7.19)
K1_SD1_D1/SPI1_D1: POWER&RTC (P12.4), AUDIO (P6.10), OK10xx_S V1.1 (U1.68), TF_CARD&USB (P17.8)
K7_PMIC_ON_REQ: POWER&RTC (R73.2), OK10xx_S V1.1 (U1.17)
K10_CSI_HSYNC: POWER&RTC (P14.10), OK10xx_S V1.1 (U1.6), Camera (P7.9)
K11_I2C1_SDA: POWER&RTC (P14.9 U9.5 U10.5), AUDIO (U13.18), OK10xx_S V1.1 (R18.1 U1.8), Camera (P7.3)
K12_CSI_MCLK: POWER&RTC (P22.10), OK10xx_S V1.1 (U1.99), Camera (P7.13)
K14_UART1_TXD: POWER&RTC (P14.1), OK10xx_S V1.1 (U1.24 U11.10)
L5_FlexSPI_D3_B: POWER&RTC (P15.4), OK10xx_S V1.1 (U1.80)
L6_WAKEUP: POWER&RTC (P12.22), OK10xx_S V1.1 (K2.1 R81.1 U1.65)
L10_CAN2_RXD: POWER&RTC (P14.6), OK10xx_S V1.1 (U1.14), TF_CARD&USB (R101.1 R105.1)
L11_UART2_TXD: POWER&RTC (P14.20), AUDIO (P4.3), OK10xx_S V1.1 (U1.12)
L12_CSI_PIXCLK: POWER&RTC (P22.9), OK10xx_S V1.1 (U1.96), Camera (P7.17)
L13_CSI_D7/ROW2: POWER&RTC (P22.5), OK10xx_S V1.1 (U1.97), Camera (P7.16)
L14_UART1_RXD: POWER&RTC (P14.2), OK10xx_S V1.1 (U1.23 U11.9)
M3_FlexSPI_D1_B: POWER&RTC (P15.6), OK10xx_S V1.1 (U1.78)
M4_FlexSPI_D0_B: POWER&RTC (P15.3), OK10xx_S V1.1 (U1.79)
M5_FlexSPI_D2_B: POWER&RTC (P15.2), OK10xx_S V1.1 (U1.81)
M6_ONOFF: POWER&RTC (P12.5), OK10xx_S V1.1 (K3.1 R83.1 U1.66)
M7_POR_B: POWER&RTC (D1.1 P14.3), OK10xx_S V1.1 (U1.21)
M11_ENET1_nRST: POWER&RTC (P13.11), NET (R30.2), OK10xx_S V1.1 (U1.29)
M12_UART2_RXD: POWER&RTC (P14.7), AUDIO (P4.8), OK10xx_S V1.1 (U1.13)
M13_CSI_D8/COL3: POWER&RTC (P22.8), OK10xx_S V1.1 (U1.98), Camera (P7.14)
M14_CSI_PWDN: POWER&RTC (P14.8), OK10xx_S V1.1 (U1.11), Camera (P7.8 R16.1)
N6_OTG1_VBUS: OK10xx_S V1.1 (R82.2 U1.86), TF_CARD&USB (Q3.3)
P2_FlexSPI_CLK_B: POWER&RTC (P15.5), OK10xx_S V1.1 (U1.77)
SAL1_RXD: POWER&RTC (P13.9), AUDIO (U13.16)
USB2_N: OK10xx_S V1.1 (U1.84), TF_CARD&USB (R99.2)
USB2_P: OK10xx_S V1.1 (U1.85), TF_CARD&USB (R100.2)
USB_OTG_N: OK10xx_S V1.1 (U1.87), TF_CARD&USB (D7.1 P18.2)
USB_OTG_P: OK10xx_S V1.1 (U1.88), TF_CARD&USB (D7.2 P18.3)
V_CORE5V: POWER&RTC (P14.12 P14.13), OK10xx_S V1.1 (R41.2 U1.1 U1.2)
VDD_SNVS_IN: POWER&RTC (R76.1), OK10xx_S V1.1 (U1.27)